# EAGLE design Interface_USB3 (EAGLE 9.6.2)

## Sheet 1 of 4: USB
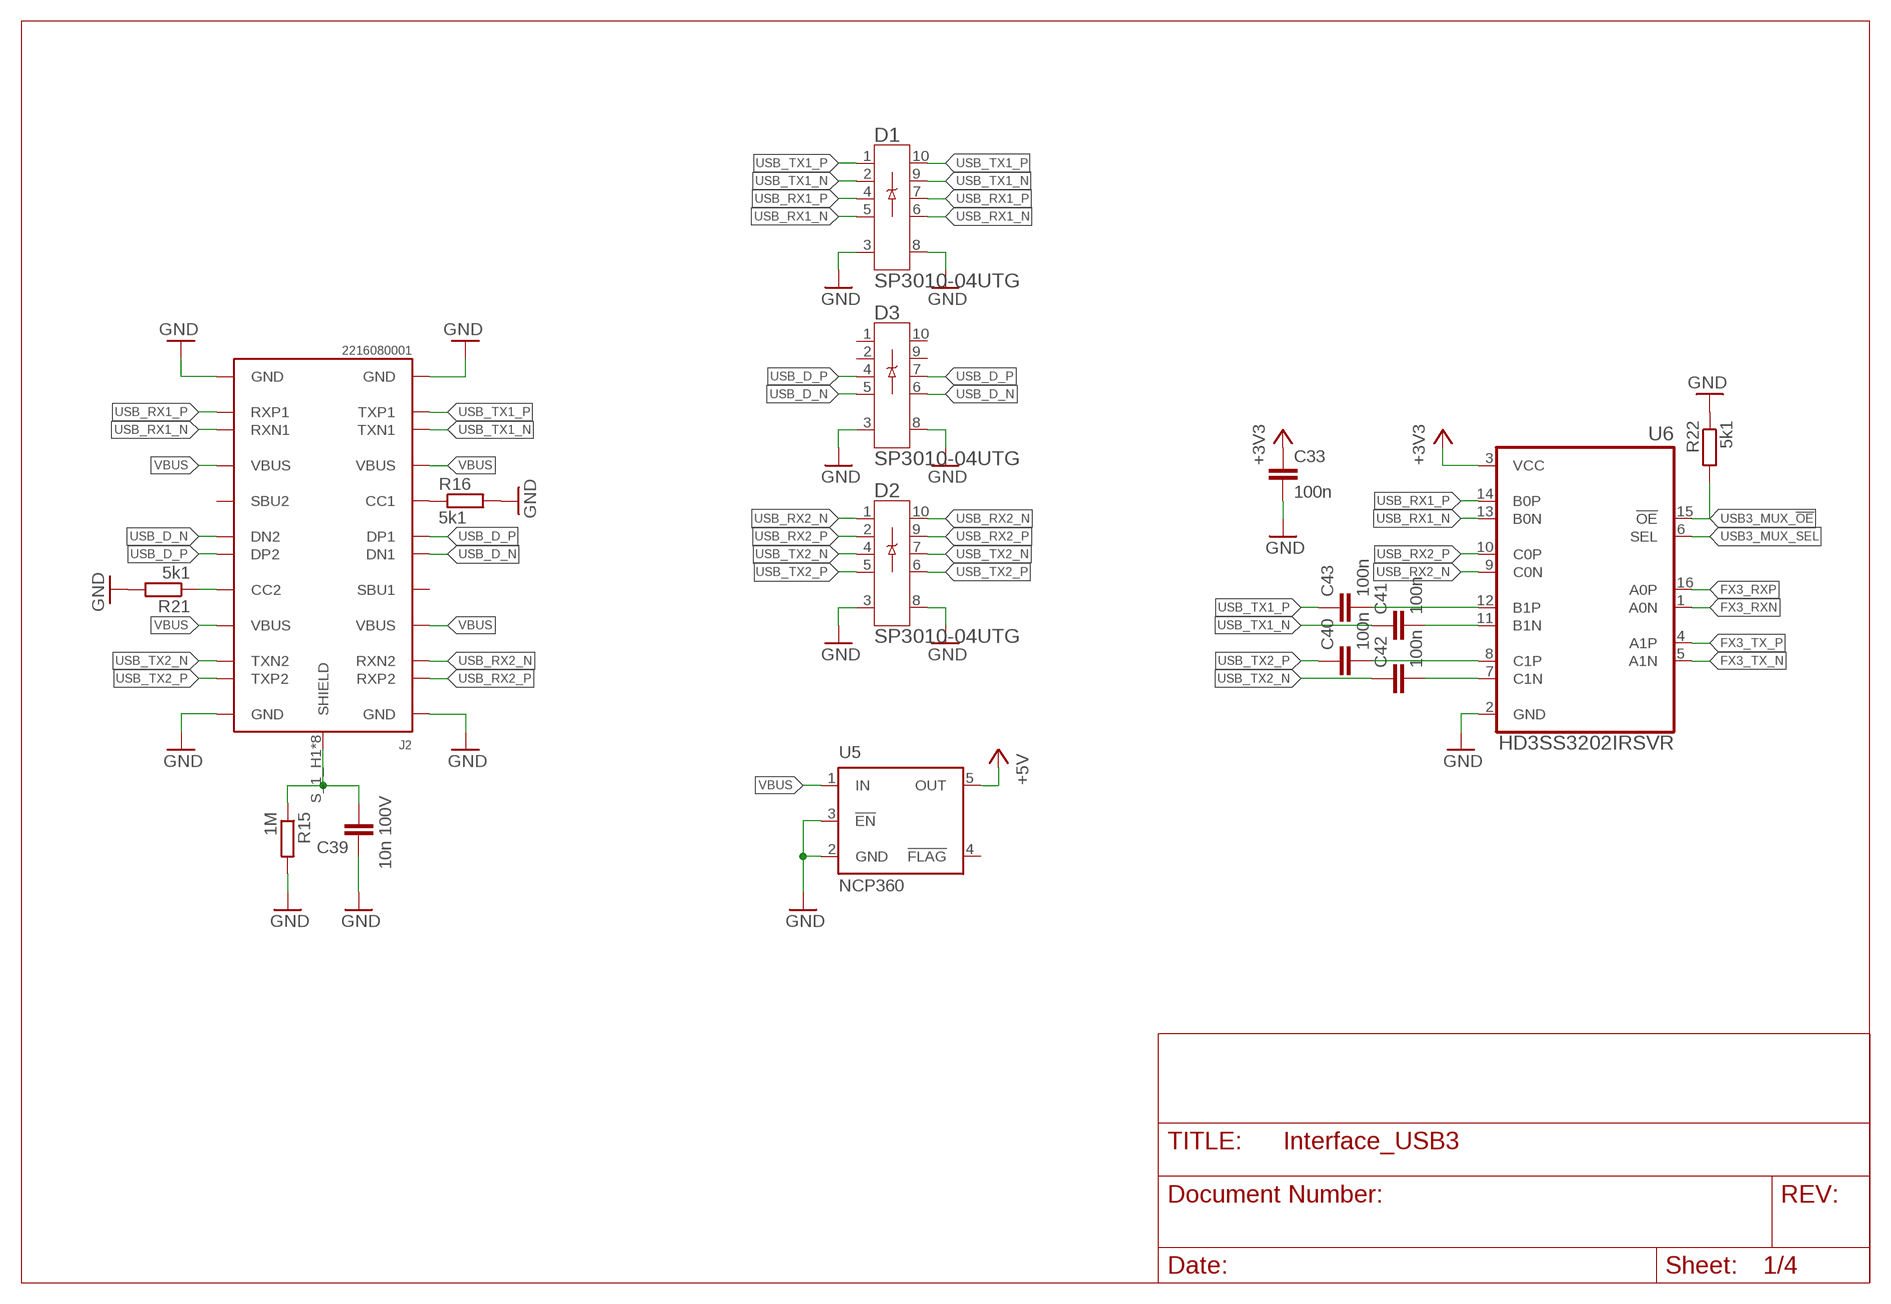
[diagram p0: schematic, sheet 1]

### Parts
C33  100n  C0402  [C0402]
C39  10n 100V  C-EUC0603  [C0603]
C40  100n  C0402  [C0402]
C41  100n  C0402  [C0402]
C42  100n  C0402  [C0402]
C43  100n  C0402  [C0402]
D1  SP3010-04UTG  [UDFEN-10_MO229_LTF]
D2  SP3010-04UTG  [UDFEN-10_MO229_LTF]
D3  SP3010-04UTG  [UDFEN-10_MO229_LTF]
J2  2216080001  [CONN_221608-0001_MOL]
R15  1M  R-EU_R0603  [R0603]
R16  5k1  R-EU_R0402  [R0402]
R21  5k1  R-EU_R0402  [R0402]
R22  5k1  R-EU_R0402  [R0402]
U5  NCP360  [TSOP-5]
U6  HD3SS3202IRSVR  [QFN40P180X260X55-16N_HD3SS3202IRSVR]

### Nets
+3V3: C33.1 U6.3(VCC) ; also sheet 2,3
+5V: U5.5(OUT) ; also sheet 2,3,4
CC1: J2.A5(CC1) R16.1
CC2: J2.B5(CC2) R21.1
FX3_RXN [diff_pair]: U6.1(A0N) ; also sheet 2
FX3_RXP [diff_pair]: U6.16(A0P) ; also sheet 2
FX3_TX_N [diff_pair]: U6.5(A1N) ; also sheet 2
FX3_TX_P [diff_pair]: U6.4(A1P) ; also sheet 2
GND: C33.2 C39.1 D1.3 D1.8 D2.3 D2.8 D3.3 D3.8 J2.A1(GND) J2.A12(GND) J2.B1(GND) J2.B12(GND) R15.2 R16.2 R21.2 R22.1 U5.2(GND) U5.3(!EN) U6.2(GND) ; also sheet 2,3,4
N$00006: C39.2 J2.S_1_H1(SHIELD) J2.S_1_H2(SHIELD) J2.S_2_H1(SHIELD) J2.S_2_H2(SHIELD) J2.S_3_H1(SHIELD) J2.S_3_H2(SHIELD) J2.S_4_H1(SHIELD) J2.S_4_H2(SHIELD) R15.1
N$00015: C42.2 U6.7(C1N)
N$00016: C40.2 U6.8(C1P)
N$00017: C41.2 U6.11(B1N)
N$00018: C43.2 U6.12(B1P)
USB3_MUX_!OE: R22.2 U6.15(!OE) ; also sheet 2
USB3_MUX_SEL: U6.6(SEL) ; also sheet 2
USB_D_N [diff_pair]: D3.5 D3.6 J2.A7(DN1) J2.B7(DN2) ; also sheet 2
USB_D_P [diff_pair]: D3.4 D3.7 J2.A6(DP1) J2.B6(DP2) ; also sheet 2
USB_RX1_N [diff_pair]: D1.5 D1.6 J2.B10(RXN1) U6.13(B0N)
USB_RX1_P [diff_pair]: D1.4 D1.7 J2.B11(RXP1) U6.14(B0P)
USB_RX2_N [diff_pair]: D2.1 D2.10 J2.A10(RXN2) U6.9(C0N)
USB_RX2_P [diff_pair]: D2.2 D2.9 J2.A11(RXP2) U6.10(C0P)
USB_TX1_N [diff_pair]: C41.1 D1.2 D1.9 J2.A3(TXN1)
USB_TX1_P [diff_pair]: C43.1 D1.1 D1.10 J2.A2(TXP1)
USB_TX2_N [diff_pair]: C42.1 D2.4 D2.7 J2.B3(TXN2)
USB_TX2_P [diff_pair]: C40.1 D2.5 D2.6 J2.B2(TXP2)
VBUS: J2.A4(VBUS) J2.A9(VBUS) J2.B4(VBUS) J2.B9(VBUS) U5.1(IN)
Unconnected: D3.1 D3.2 D3.9 D3.10 J2.A8(SBU1) J2.B8(SBU2) U5.4(!FLAG)

## Sheet 2 of 4: FX3
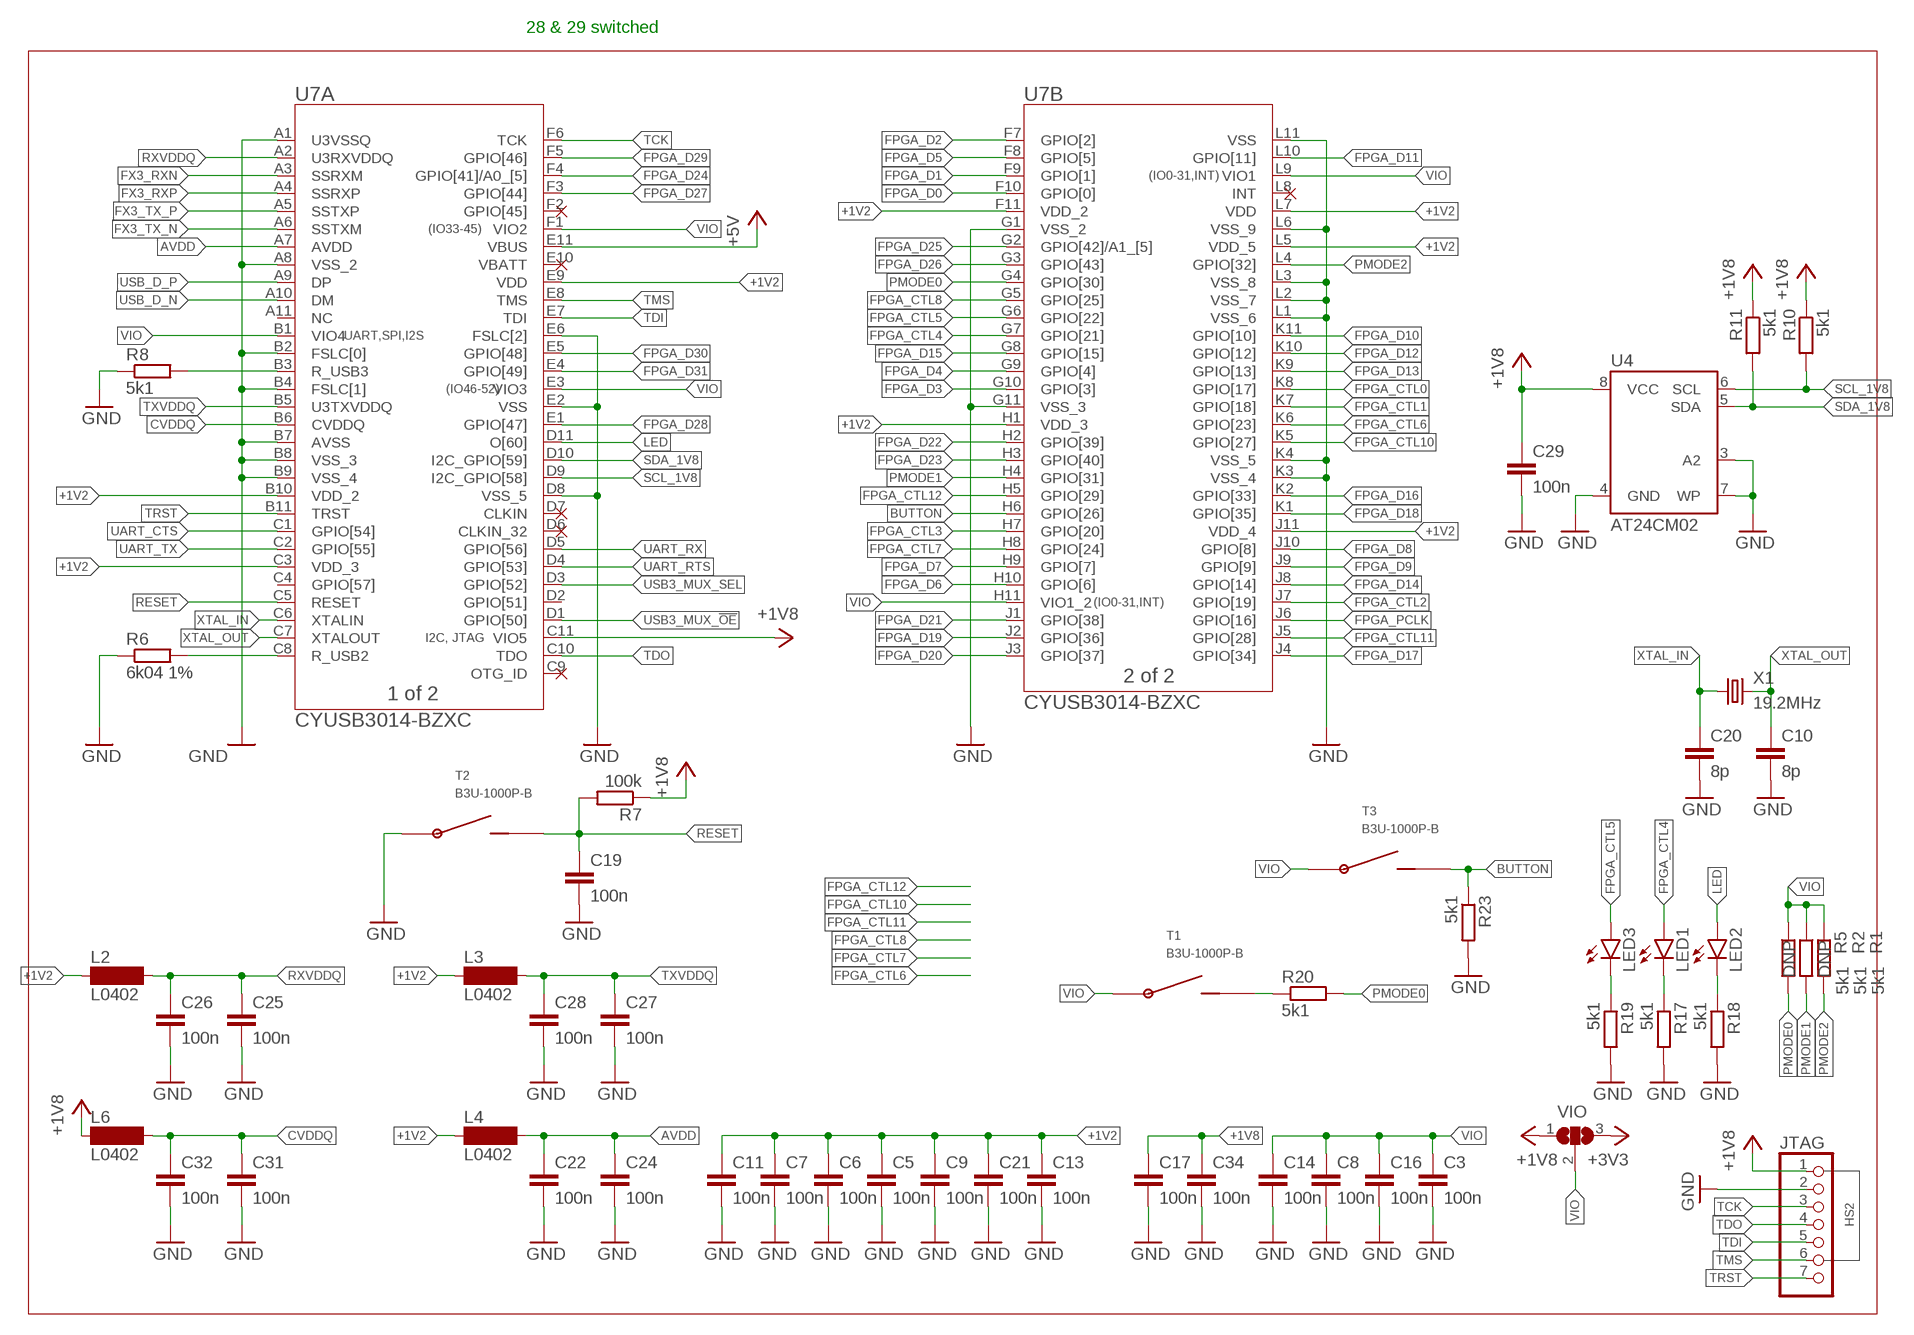
[diagram p1: schematic, sheet 2]

### Parts
C3  100n  C0402  [C0402]
C5  100n  C0402  [C0402]
C6  100n  C0402  [C0402]
C7  100n  C0402  [C0402]
C8  100n  C0402  [C0402]
C9  100n  C0402  [C0402]
C10  8p  C0402  [C0402]
C11  100n  C0402  [C0402]
C13  100n  C0402  [C0402]
C14  100n  C0402  [C0402]
C16  100n  C0402  [C0402]
C17  100n  C0402  [C0402]
C19  100n  C0402  [C0402]
C20  8p  C0402  [C0402]
C21  100n  C0402  [C0402]
C22  100n  C0402  [C0402]
C24  100n  C0402  [C0402]
C25  100n  C0402  [C0402]
C26  100n  C0402  [C0402]
C27  100n  C0402  [C0402]
C28  100n  C0402  [C0402]
C29  100n  C0402  [C0402]
C31  100n  C0402  [C0402]
C32  100n  C0402  [C0402]
C34  100n  C0402  [C0402]
JTAG  PINHD-1X7_2.00  [1X07M]
L2  L0402  [C0402]
L3  L0402  [C0402]
L4  L0402  [C0402]
L6  L0402  [C0402]
LED1  LEDCHIPLED_0603  [CHIPLED_0603]
LED2  LEDCHIPLED_0603  [CHIPLED_0603]
LED3  LEDCHIPLED_0603  [CHIPLED_0603]
R1  5k1  R-EU_R0402  [R0402]
R2  5k1  R-EU_R0402  [R0402]
R5  5k1  R-EU_R0402  [R0402]
R6  6k04 1%  R-EU_R0402  [R0402]
R7  100k  R-EU_R0402  [R0402]
R8  5k1  R-EU_R0402  [R0402]
R10  5k1  R-EU_R0402  [R0402]
R11  5k1  R-EU_R0402  [R0402]
R17  5k1  R-EU_R0402  [R0402]
R18  5k1  R-EU_R0402  [R0402]
R19  5k1  R-EU_R0402  [R0402]
R20  5k1  R-EU_R0402  [R0402]
R23  5k1  R-EU_R0402  [R0402]
T1  B3U-1000P-B  [B3U-1000P-B]
T2  B3U-1000P-B  [B3U-1000P-B]
T3  B3U-1000P-B  [B3U-1000P-B]
U4  AT24CM02  [SOIC8]
U7  CYUSB3014-BZXC  [PG-TFBGA-121-800_INF]
VIO  SJ2W  [SJ_2]
X1  19.2MHz  CRYSTAL-2520  [2520]

### Nets
+1V2: C5.1 C6.1 C7.1 C9.1 C11.1 C13.1 C21.1 L2.1 L3.1 L4.1 U7.B10(A:VDD_2) U7.C3(A:VDD_3) U7.E9(A:VDD) U7.F11(B:VDD_2) U7.H1(B:VDD_3) U7.J11(B:VDD_4) U7.L5(B:VDD_5) U7.L7(B:VDD) ; also sheet 3
+1V8: C17.1 C29.1 C34.1 JTAG.1 L6.1 R7.1 R10.1 R11.1 U4.8(VCC) U7.C11(A:VIO5) VIO.1 ; also sheet 3
+3V3: VIO.3 ; also sheet 1,3
+5V: U7.E11(A:VBUS) ; also sheet 1,3,4
AVDD: C22.1 C24.1 L4.2 U7.A7(A:AVDD)
BUTTON: R23.1 T3.P$2 U7.H6(B:GPIO[26])
CVDDQ: C31.1 C32.1 L6.2 U7.B6(A:CVDDQ)
FPGA_CTL0: U7.K8(B:GPIO[17]) ; also sheet 4
FPGA_CTL1: U7.K7(B:GPIO[18]) ; also sheet 4
FPGA_CTL2: U7.J7(B:GPIO[19]) ; also sheet 4
FPGA_CTL3: U7.H7(B:GPIO[20]) ; also sheet 4
FPGA_CTL4: LED1.A U7.G7(B:GPIO[21])
FPGA_CTL5: LED3.A U7.G6(B:GPIO[22])
FPGA_CTL6: U7.K6(B:GPIO[23])
FPGA_CTL7: U7.H8(B:GPIO[24])
FPGA_CTL8: U7.G5(B:GPIO[25])
FPGA_CTL10: U7.K5(B:GPIO[27])
FPGA_CTL11: U7.J5(B:GPIO[28])
FPGA_CTL12: U7.H5(B:GPIO[29])
FPGA_D0: U7.F10(B:GPIO[0]) ; also sheet 4
FPGA_D1: U7.F9(B:GPIO[1]) ; also sheet 4
FPGA_D2: U7.F7(B:GPIO[2]) ; also sheet 4
FPGA_D3: U7.G10(B:GPIO[3]) ; also sheet 4
FPGA_D4: U7.G9(B:GPIO[4]) ; also sheet 4
FPGA_D5: U7.F8(B:GPIO[5]) ; also sheet 4
FPGA_D6: U7.H10(B:GPIO[6]) ; also sheet 4
FPGA_D7: U7.H9(B:GPIO[7]) ; also sheet 4
FPGA_D8: U7.J10(B:GPIO[8]) ; also sheet 4
FPGA_D9: U7.J9(B:GPIO[9]) ; also sheet 4
FPGA_D10: U7.K11(B:GPIO[10]) ; also sheet 4
FPGA_D11: U7.L10(B:GPIO[11]) ; also sheet 4
FPGA_D12: U7.K10(B:GPIO[12]) ; also sheet 4
FPGA_D13: U7.K9(B:GPIO[13]) ; also sheet 4
FPGA_D14: U7.J8(B:GPIO[14]) ; also sheet 4
FPGA_D15: U7.G8(B:GPIO[15]) ; also sheet 4
FPGA_D16: U7.K2(B:GPIO[33]) ; also sheet 4
FPGA_D17: U7.J4(B:GPIO[34]) ; also sheet 4
FPGA_D18: U7.K1(B:GPIO[35]) ; also sheet 4
FPGA_D19: U7.J2(B:GPIO[36]) ; also sheet 4
FPGA_D20: U7.J3(B:GPIO[37]) ; also sheet 4
FPGA_D21: U7.J1(B:GPIO[38]) ; also sheet 4
FPGA_D22: U7.H2(B:GPIO[39]) ; also sheet 4
FPGA_D23: U7.H3(B:GPIO[40]) ; also sheet 4
FPGA_D24: U7.F4(A:GPIO[41]/A0_[5]) ; also sheet 4
FPGA_D25: U7.G2(B:GPIO[42]/A1_[5]) ; also sheet 4
FPGA_D26: U7.G3(B:GPIO[43]) ; also sheet 4
FPGA_D27: U7.F3(A:GPIO[44]) ; also sheet 4
FPGA_D28: U7.E1(A:GPIO[47]) ; also sheet 4
FPGA_D29: U7.F5(A:GPIO[46]) ; also sheet 4
FPGA_D30: U7.E5(A:GPIO[48]) ; also sheet 4
FPGA_D31: U7.E4(A:GPIO[49]) ; also sheet 4
FPGA_PCLK: U7.J6(B:GPIO[16]) ; also sheet 4
FX3_RXN [diff_pair]: U7.A3(A:SSRXM) ; also sheet 1
FX3_RXP [diff_pair]: U7.A4(A:SSRXP) ; also sheet 1
FX3_TX_N [diff_pair]: U7.A6(A:SSTXM) ; also sheet 1
FX3_TX_P [diff_pair]: U7.A5(A:SSTXP) ; also sheet 1
GND: C3.2 C5.2 C6.2 C7.2 C8.2 C9.2 C10.2 C11.2 C13.2 C14.2 C16.2 C17.2 C19.2 C20.2 C21.2 C22.2 C24.2 C25.2 C26.2 C27.2 C28.2 C29.2 C31.2 C32.2 C34.2 JTAG.2 R6.1 R8.1 R17.2 R18.2 R19.2 R23.2 T2.P$1 U4.3(A2) U4.4(GND) U4.7(WP) U7.A1(A:U3VSSQ) U7.A8(A:VSS_2) U7.B2(A:FSLC[0]) U7.B4(A:FSLC[1]) U7.B7(A:AVSS) U7.B8(A:VSS_3) U7.B9(A:VSS_4) U7.D8(A:VSS_5) U7.E2(A:VSS) U7.E6(A:FSLC[2]) U7.G1(B:VSS_2) U7.G11(B:VSS_3) U7.K3(B:VSS_4) U7.K4(B:VSS_5) U7.L1(B:VSS_6) U7.L2(B:VSS_7) U7.L3(B:VSS_8) U7.L6(B:VSS_9) U7.L11(B:VSS) ; also sheet 1,3,4
LED: LED2.A U7.D11(A:O[60])
N$00003: LED2.C R18.1
N$00009: R6.2 U7.C8(A:R_USB2)
N$00011: R8.2 U7.B3(A:R_USB3)
N$00013: LED1.C R17.1
N$00014: LED3.C R19.1
N$00019: R20.1 T1.P$2
PMODE0: R5.2 R20.2 U7.G4(B:GPIO[30])
PMODE1: R2.2 U7.H4(B:GPIO[31])
PMODE2: R1.2 U7.L4(B:GPIO[32])
RESET: C19.1 R7.2 T2.P$2 U7.C5(A:RESET)
RXVDDQ: C25.1 C26.1 L2.2 U7.A2(A:U3RXVDDQ)
SCL_1V8: R10.2 U4.6(SCL) U7.D9(A:I2C_GPIO[58])
SDA_1V8: R11.2 U4.5(SDA) U7.D10(A:I2C_GPIO[59])
TCK: JTAG.3 U7.F6(A:TCK)
TDI: JTAG.5 U7.E7(A:TDI)
TDO: JTAG.4 U7.C10(A:TDO)
TMS: JTAG.6 U7.E8(A:TMS)
TRST: JTAG.7 U7.B11(A:TRST)
TXVDDQ: C27.1 C28.1 L3.2 U7.B5(A:U3TXVDDQ)
UART_CTS: U7.C1(A:GPIO[54]) ; also sheet 4
UART_RTS: U7.D4(A:GPIO[53]) ; also sheet 4
UART_RX: U7.D5(A:GPIO[56]) ; also sheet 4
UART_TX: U7.C2(A:GPIO[55]) ; also sheet 4
USB3_MUX_!OE: U7.D1(A:GPIO[50]) ; also sheet 1
USB3_MUX_SEL: U7.D3(A:GPIO[52]) ; also sheet 1
USB_D_N [diff_pair]: U7.A10(A:DM) ; also sheet 1
USB_D_P [diff_pair]: U7.A9(A:DP) ; also sheet 1
VIO: C3.1 C8.1 C14.1 C16.1 R1.1 R2.1 R5.1 T1.P$1 T3.P$1 U7.B1(A:VIO4) U7.E3(A:VIO3) U7.F1(A:VIO2) U7.H11(B:VIO1_2) U7.L9(B:VIO1) VIO.2
XTAL_IN: C20.1 U7.C6(A:XTALIN) X1.1
XTAL_OUT: C10.1 U7.C7(A:XTALOUT) X1.3
Unconnected: U7.A11(A:NC) U7.C4(A:GPIO[57]) U7.C9(A:OTG_ID) U7.D2(A:GPIO[51]) U7.D6(A:CLKIN_32) U7.D7(A:CLKIN) U7.F2(A:GPIO[45]) U7.L8(B:INT)

### Notes on the sheet
- 28 & 29 switched
- (IO0-31,INT)
- (IO33-45)
- UART,SPI,I2S
- (IO46-52)
- (IO0-31,INT)
- I2C, JTAG
- HS2

## Sheet 3 of 4: Power
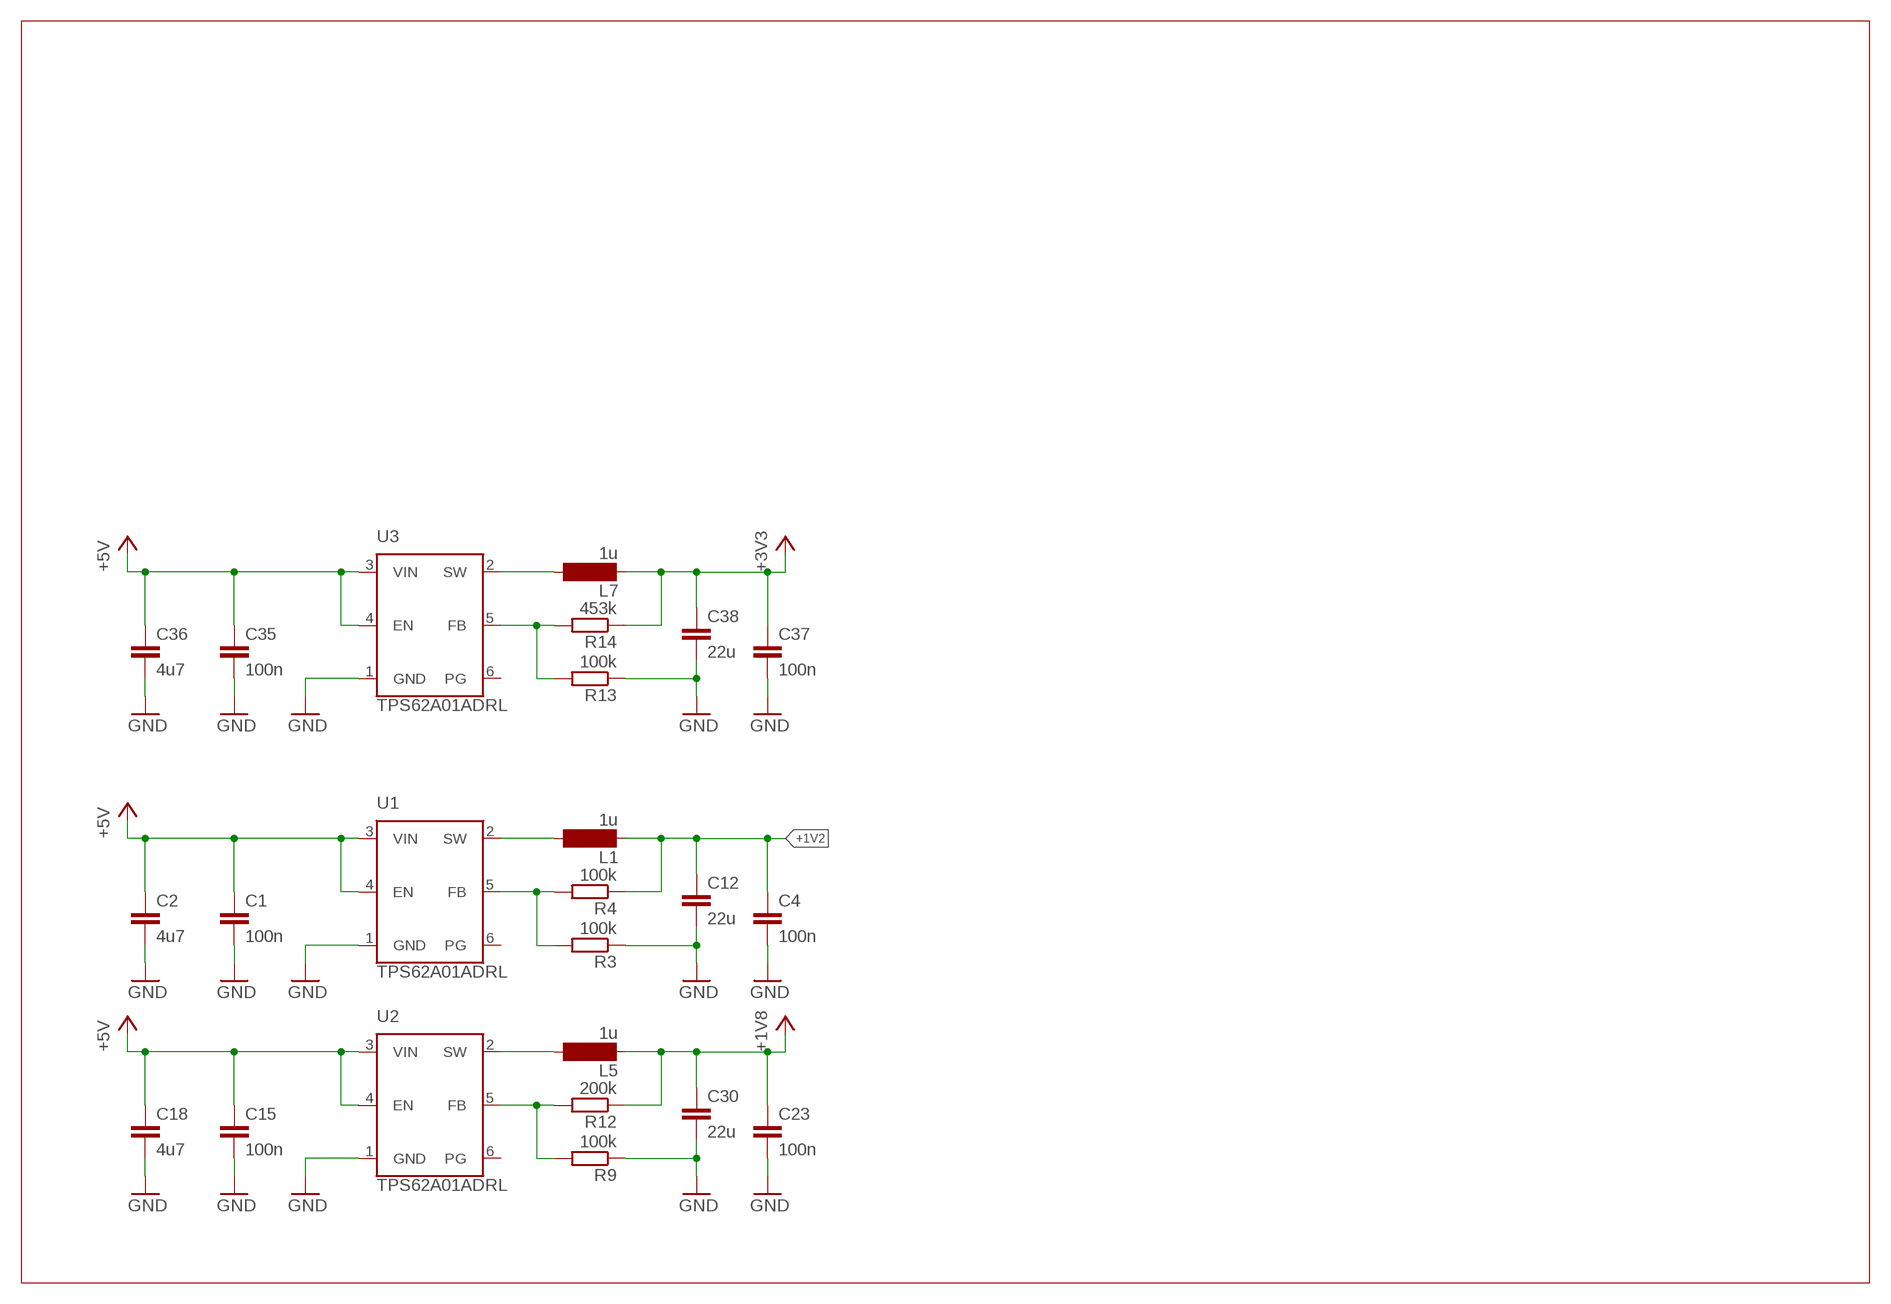
[diagram p2: schematic, sheet 3]

### Parts
C1  100n  C0402  [C0402]
C2  4u7  C-EUC0603  [C0603]
C4  100n  C0402  [C0402]
C12  22u  C-EUC0603  [C0603]
C15  100n  C0402  [C0402]
C18  4u7  C-EUC0603  [C0603]
C23  100n  C0402  [C0402]
C30  22u  C-EUC0603  [C0603]
C35  100n  C0402  [C0402]
C36  4u7  C-EUC0603  [C0603]
C37  100n  C0402  [C0402]
C38  22u  C-EUC0603  [C0603]
L1  1u  L1008  [L1008]
L5  1u  L1008  [L1008]
L7  1u  L1008  [L1008]
R3  100k  R-EU_R0402  [R0402]
R4  100k  R-EU_R0402  [R0402]
R9  100k  R-EU_R0402  [R0402]
R12  200k  R-EU_R0402  [R0402]
R13  100k  R-EU_R0402  [R0402]
R14  453k  R-EU_R0402  [R0402]
U1  TPS62A01ADRL  [SOTFL50P160X60-6N]
U2  TPS62A01ADRL  [SOTFL50P160X60-6N]
U3  TPS62A01ADRL  [SOTFL50P160X60-6N]

### Nets
+1V2: C4.1 C12.1 L1.1 R4.1 ; also sheet 2
+1V8: C23.1 C30.1 L5.1 R12.1 ; also sheet 2
+3V3: C37.1 C38.1 L7.1 R14.1 ; also sheet 1,2
+5V: C1.1 C2.1 C15.1 C18.1 C35.1 C36.1 U1.3(VIN) U1.4(EN) U2.3(VIN) U2.4(EN) U3.3(VIN) U3.4(EN) ; also sheet 1,2,4
GND: C1.2 C2.2 C4.2 C12.2 C15.2 C18.2 C23.2 C30.2 C35.2 C36.2 C37.2 C38.2 R3.1 R9.1 R13.1 U1.1(GND) U2.1(GND) U3.1(GND) ; also sheet 1,2,4
N$00005: L1.2 U1.2(SW)
N$00010: L7.2 U3.2(SW)
N$00012: R13.2 R14.2 U3.5(FB)
N$00040: R3.2 R4.2 U1.5(FB)
N$00045: L5.2 U2.2(SW)
N$00049: R9.2 R12.2 U2.5(FB)
Unconnected: U1.6(PG) U2.6(PG) U3.6(PG)

## Sheet 4 of 4
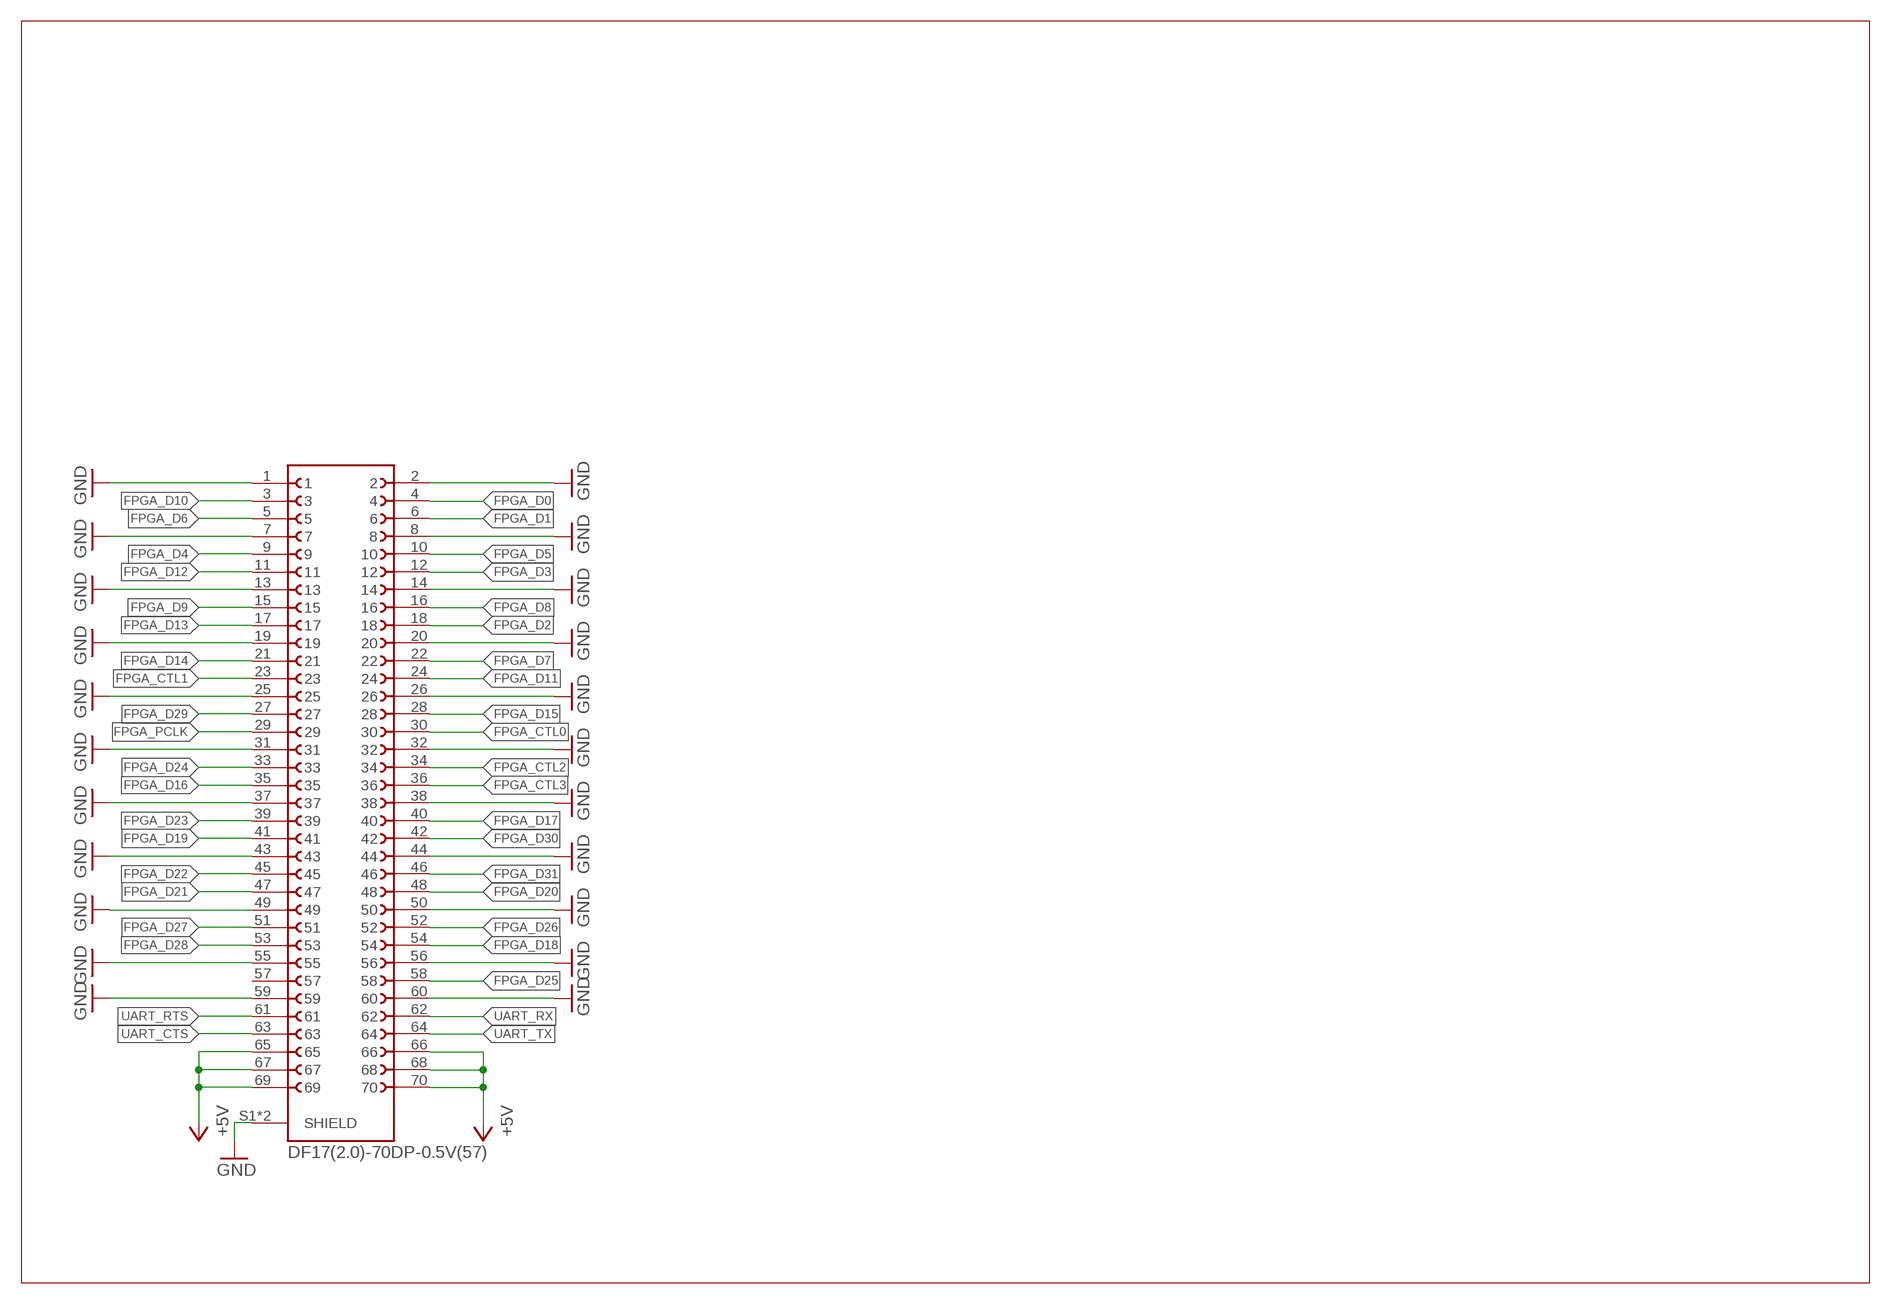
[diagram p3: schematic, sheet 4]

### Parts
J1  DF17(2.0)-70DP-0.5V(57)  [DF17(2.0)-70DP-0.5V(57)]

### Nets
+5V: J1.65 J1.66 J1.67 J1.68 J1.69 J1.70 ; also sheet 1,2,3
FPGA_CTL0: J1.30 ; also sheet 2
FPGA_CTL1: J1.23 ; also sheet 2
FPGA_CTL2: J1.34 ; also sheet 2
FPGA_CTL3: J1.36 ; also sheet 2
FPGA_D0: J1.4 ; also sheet 2
FPGA_D1: J1.6 ; also sheet 2
FPGA_D2: J1.18 ; also sheet 2
FPGA_D3: J1.12 ; also sheet 2
FPGA_D4: J1.9 ; also sheet 2
FPGA_D5: J1.10 ; also sheet 2
FPGA_D6: J1.5 ; also sheet 2
FPGA_D7: J1.22 ; also sheet 2
FPGA_D8: J1.16 ; also sheet 2
FPGA_D9: J1.15 ; also sheet 2
FPGA_D10: J1.3 ; also sheet 2
FPGA_D11: J1.24 ; also sheet 2
FPGA_D12: J1.11 ; also sheet 2
FPGA_D13: J1.17 ; also sheet 2
FPGA_D14: J1.21 ; also sheet 2
FPGA_D15: J1.28 ; also sheet 2
FPGA_D16: J1.35 ; also sheet 2
FPGA_D17: J1.40 ; also sheet 2
FPGA_D18: J1.54 ; also sheet 2
FPGA_D19: J1.41 ; also sheet 2
FPGA_D20: J1.48 ; also sheet 2
FPGA_D21: J1.47 ; also sheet 2
FPGA_D22: J1.45 ; also sheet 2
FPGA_D23: J1.39 ; also sheet 2
FPGA_D24: J1.33 ; also sheet 2
FPGA_D25: J1.58 ; also sheet 2
FPGA_D26: J1.52 ; also sheet 2
FPGA_D27: J1.51 ; also sheet 2
FPGA_D28: J1.53 ; also sheet 2
FPGA_D29: J1.27 ; also sheet 2
FPGA_D30: J1.42 ; also sheet 2
FPGA_D31: J1.46 ; also sheet 2
FPGA_PCLK: J1.29 ; also sheet 2
GND: J1.1 J1.2 J1.7 J1.8 J1.13 J1.14 J1.19 J1.20 J1.25 J1.26 J1.31 J1.32 J1.37 J1.38 J1.43 J1.44 J1.49 J1.50 J1.55 J1.56 J1.59 J1.60 J1.S1(SHIELD) J1.S2(SHIELD) ; also sheet 1,2,3
UART_CTS: J1.63 ; also sheet 2
UART_RTS: J1.61 ; also sheet 2
UART_RX: J1.62 ; also sheet 2
UART_TX: J1.64 ; also sheet 2
Unconnected: J1.57

## Power pins joined to a net without a drawn wire
VBATT: U7.E10(A:VBATT)

## Library data of the parts
C1 C3-C9 C11 C13-C17 C19 C21-C29 C31-C35 C37 C40-C43 = misc:C; LCSC: C1525
C2 C18 C36 = rcl:C-EU: CAPACITOR, European symbol; LCSC: C19666
C10 C20 = misc:C; LCSC: C281765
C12 C30 C38 = rcl:C-EU: CAPACITOR, European symbol; LCSC: C723633
C39 = rcl:C-EU: CAPACITOR, European symbol; LCSC: C84709; SPICEPREFIX: C
D1-D3 = onsemi:SP3010-04UTG; LCSC: C126837; MANUFACTURER_NAME: Littelfuse Inc; MPN: SP3010-04UTG
J1 = Hirose:DF17(2.0)-70DP-0.5V(57)
J2 = con-molex:2216080001; DIGIKEY: 900-2216080001CT-ND; MANUFACTURER_PART_NUMBER: 2216080001; MFR_NAME: Molex Connector Corporation; TYPE: USB, DVI, HDMI, Connectors
JTAG = pinhead-1:PINHD-1X7: PIN HEADER
L1 L5 L7 = misc:L; DIGIKEY: 490-5112-1-ND; LCSC: C86091; MPN: LQM2HPN1R0MG0L
L2-L4 L6 = misc:L; LCSC: C88970
LED1-LED3 = led:LED: LED OSRAM: - CHIPLED LG R971, LG N971, LY N971, LG Q971, LY Q971, LO R971, LY R971 LH N974, LH R974 LS Q976, LO Q976, LY Q976 LO Q996 - Hyper CHIPLED LW Q18S LB Q993, LB Q99A, LB R99A - SideLED LS A670, LO A670, LY A670, LG A670, LP A670 LB A673, LV A673, LT A673, LW A673 LH A674 LY A675 LS A676, LA A676, LO A676, LY A676, LW A676 LS A679, LY A679, LG A679 - Hyper Micro SIDELED® LS Y876, LA Y876, LO Y876, LY Y876 LT Y87S - SmartLED LW L88C, LW L88S LB L89C, LB L89S, LG L890 LS L89K, LO L89K, LY L89K LS L896, LA L896, LO L896, LY L896 - TOPLED LS T670, LO T670, LY T670, LG T670, LP T670 LSG T670, LSP T670, LSY T670, LOP T670, LYG T670 LG T671, LOG T671, LSG T671 LB T673, LV T673, LT T673, LW T673 LH T674 LS T676, LA T676, LO T676, LY T676, LB T676, LH T676, LSB T676, LW T676 LB T67C, LV T67C, LT T67C, LS T67K, LO T67K, LY T67K, LW E67C LS E67B, LA E67B, LO E67B, LY E67B, LB E67C, LV E67C, LT E67C LW T67C LS T679, LY T679, LG T679 LS T770, LO T770, LY T770, LG T770, LP T770 LB T773, LV T773, LT T773, LW T773 LH T774 LS E675, LA E675, LY E675, LS T675 LS T776, LA T776, LO T776, LY T776, LB T776 LHGB T686 LT T68C, LB T68C - Hyper Mini TOPLED® LB M676 - Mini TOPLED Santana® LG M470 LS M47K, LO M47K, LY M47K Source: http://www.osram.convergy.de LUXEON: - LUMILED® LXK2-PW12-R00, LXK2-PW12-S00, LXK2-PW14-U00, LXK2-PW14-V00 LXK2-PM12-R00, LXK2-PM12-S00, LXK2-PM14-U00 LXK2-PE12-Q00, LXK2-PE12-R00, LXK2-PE12-S00, LXK2-PE14-T00, LXK2-PE14-U00 LXK2-PB12-K00, LXK2-PB12-L00, LXK2-PB12-M00, LXK2-PB14-N00, LXK2-PB14-P00, LXK2-PB14-Q00 LXK2-PR12-L00, LXK2-PR12-M00, LXK2-PR14-Q00, LXK2-PR14-R00 LXK2-PD12-Q00, LXK2-PD12-R00, LXK2-PD12-S00 LXK2-PH12-R00, LXK2-PH12-S00 LXK2-PL12-P00, LXK2-PL12-Q00, LXK2-PL12-R00 Source: www.luxeon.com KINGBRIGHT: KA-3528ASYC Source: www.kingbright.com; LCSC: C7493803
R1 R5 = rcl:R-EU_: RESISTOR, European symbol; DNP: DNP; LCSC: C105872; SPICEPREFIX: R
R2 R8 R10 R11 R16-R23 = rcl:R-EU_: RESISTOR, European symbol; LCSC: C105872; SPICEPREFIX: R
R3 R4 R7 R9 R13 = rcl:R-EU_: RESISTOR, European symbol; DIGIKEY: RMCF0402FT100KCT-ND; LCSC: C60491; SPICEPREFIX: R
R6 = rcl:R-EU_: RESISTOR, European symbol; LCSC: C97819; SPICEPREFIX: R
R12 = rcl:R-EU_: RESISTOR, European symbol; DIGIKEY: 311-200KLRCT-ND; LCSC: C114763; SPICEPREFIX: R
R14 = rcl:R-EU_: RESISTOR, European symbol; LCSC: C137978; SPICEPREFIX: R
R15 = rcl:R-EU_: RESISTOR, European symbol; LCSC: C22935; SPICEPREFIX: R
T1-T3 = Filterschieber-Platine:B3U-1000P-B; FARNELL: 1333654; MBM: 5; PREIS: 1,02
U1-U3 = TPS62A01DRLR:TPS62A01ADRL; DESCRIPTION: 2.5V-5.5V input, 1-A high efficiency step-down converter in 2x2 QFN or SOT563 package; DIGIKEY: 296-TPS62A01ADRLRCT-ND; HEIGHT: 0.6mm; LCSC: C5181455; MANUFACTURER_NAME: Texas Instruments; MANUFACTURER_PART_NUMBER: TPS62A01ADRLR; MOUSER: 595-TPS62A01ADRLR
U4 = atmel-2005:AT24CM02: Microchip AT24CM02 I²C-Compatible (Two-Wire) Serial EEPROM 2‑Mbit (262,144 x 8); DIGIKEY: AT24CM02-SSHD-B-ND; LCSC: C779670
U5 = onsemi:NCP360: onsemi NCP360, NCV360 USB Positive Overvoltage Protection Controller; DIGIKEY: NCP360SNT1GOSCT-ND; LCSC: C603707
U6 = texas:HD3SS3202IRSVR; LCSC: C2150836; MANUFACTURER: Texas Instruments; MAXIMUM_PACKAGE_HEIGHT: 0.55 mm; STANDARD: IPC 7351B
U7 = cypress:CYUSB3014-BZXC; LCSC: C462526; MPN: CYUSB3014-BZXC
VIO = jumper:SJ2W: SMD solder JUMPER
X1 = crystal:CRYSTAL: Crystal Resonator; DIGIKEY: XC3048CT-ND; LCSC: C24833836

## Net classes
0 default: width 0.15 mm, drill 0.3 mm
1 diff_pair: width 0.15 mm, drill 0.3 mm

## Board
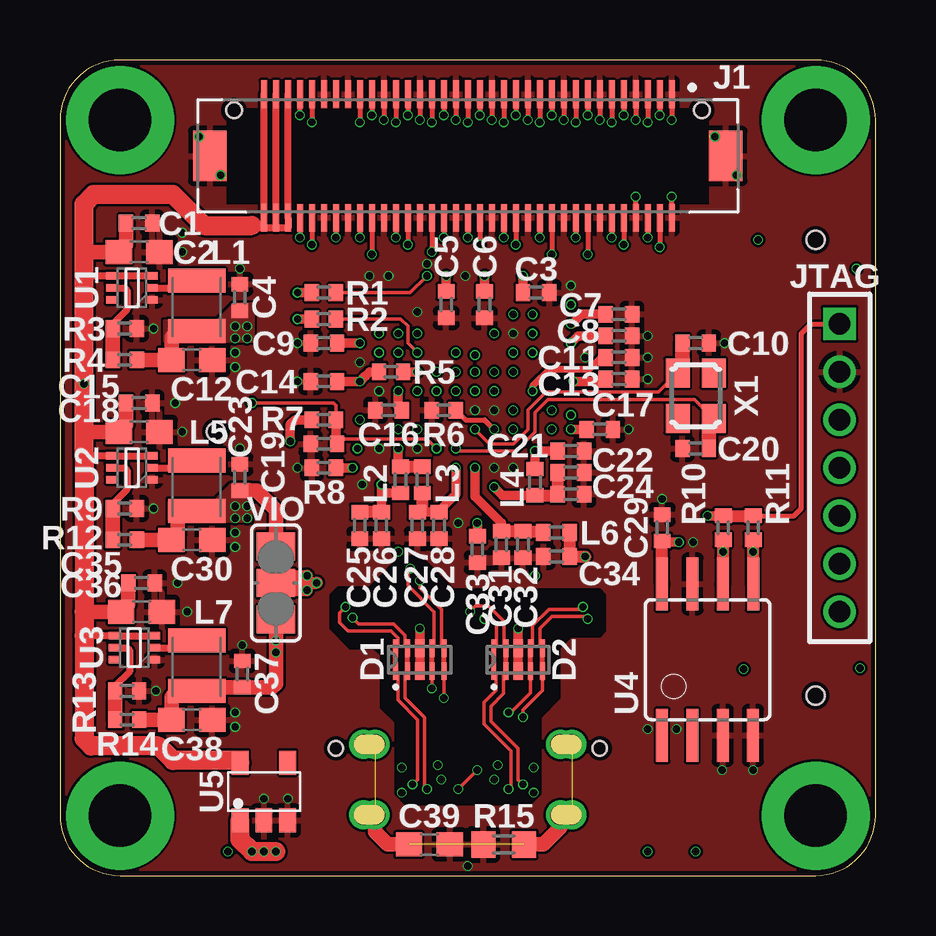
[diagram p4: board, top side]
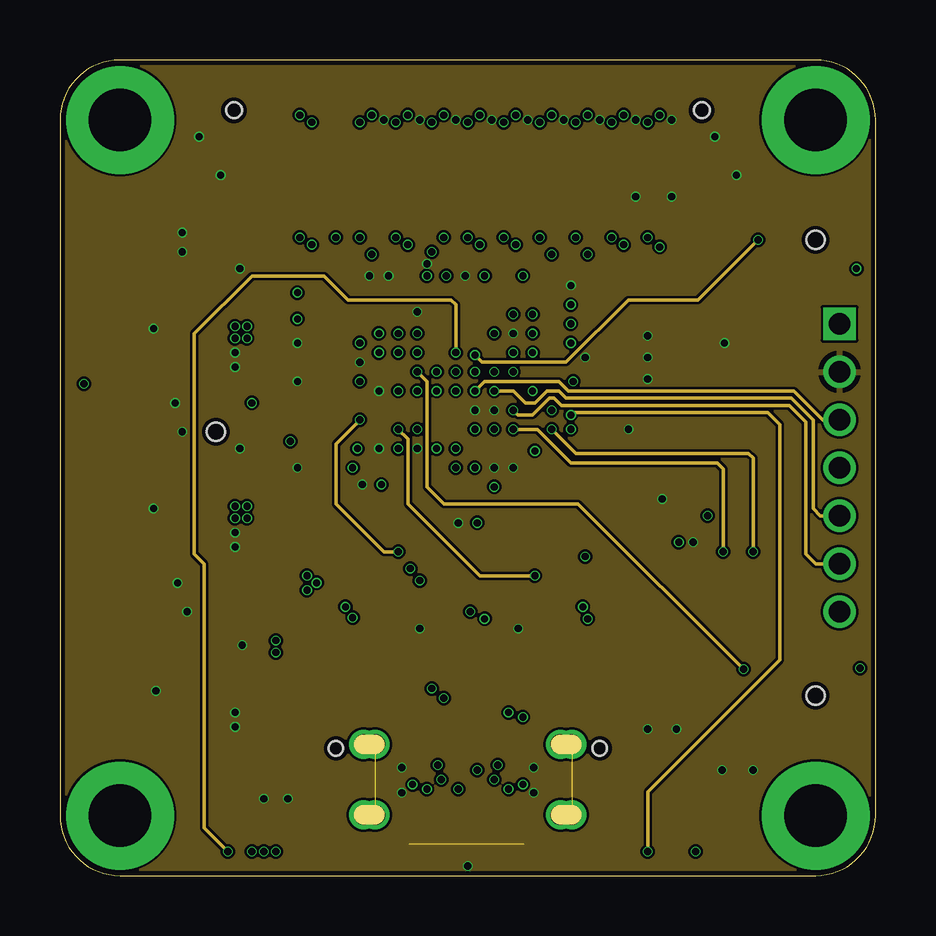
[diagram p5: board, inner layer Route2]
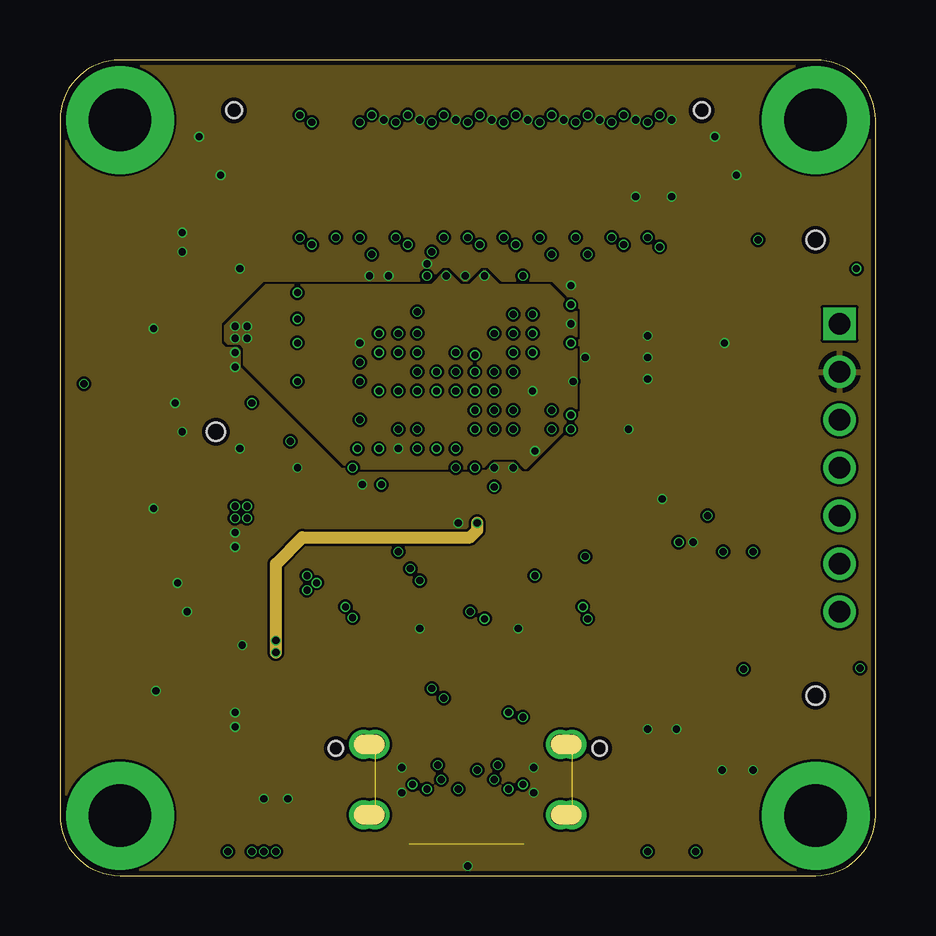
[diagram p6: board, inner layer Route3]
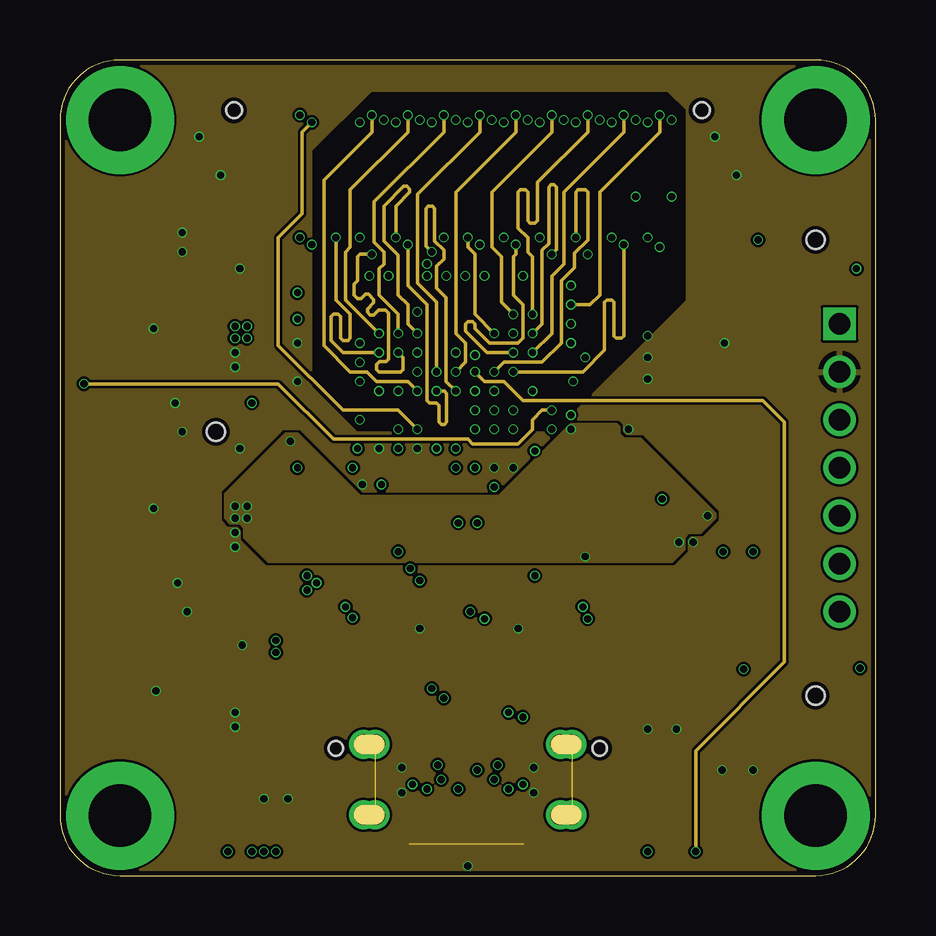
[diagram p7: board, inner layer Route14]
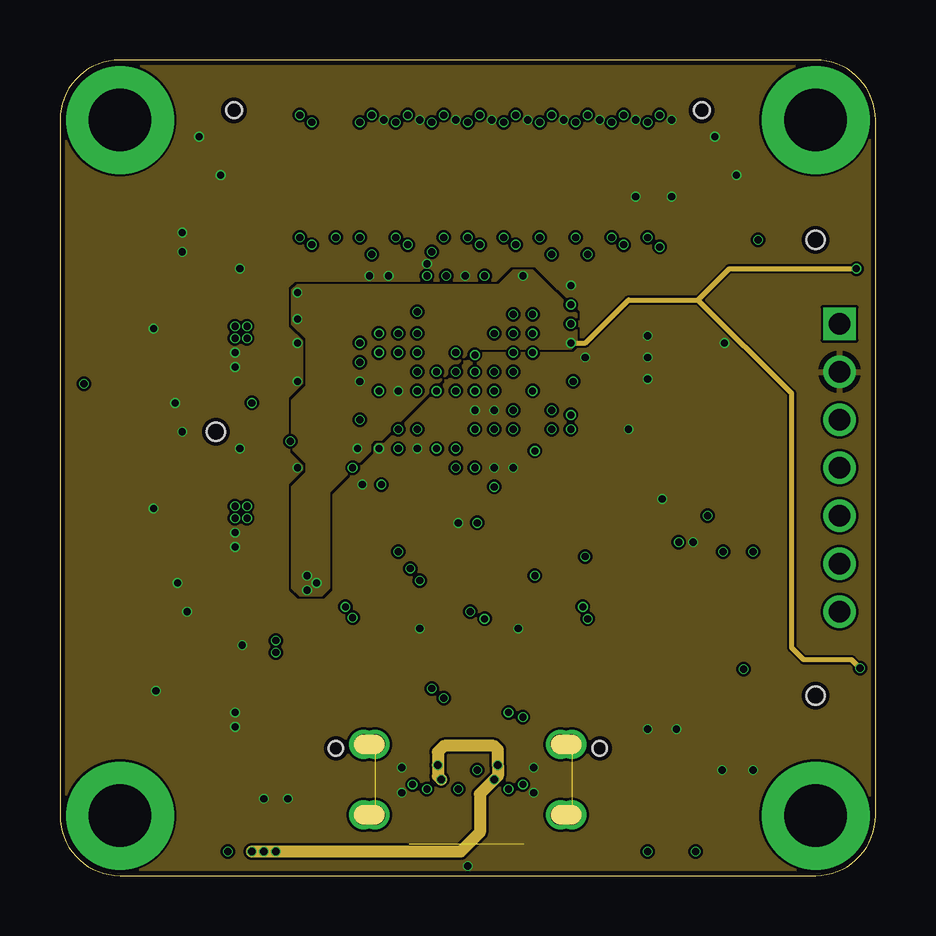
[diagram p8: board, inner layer Route15]
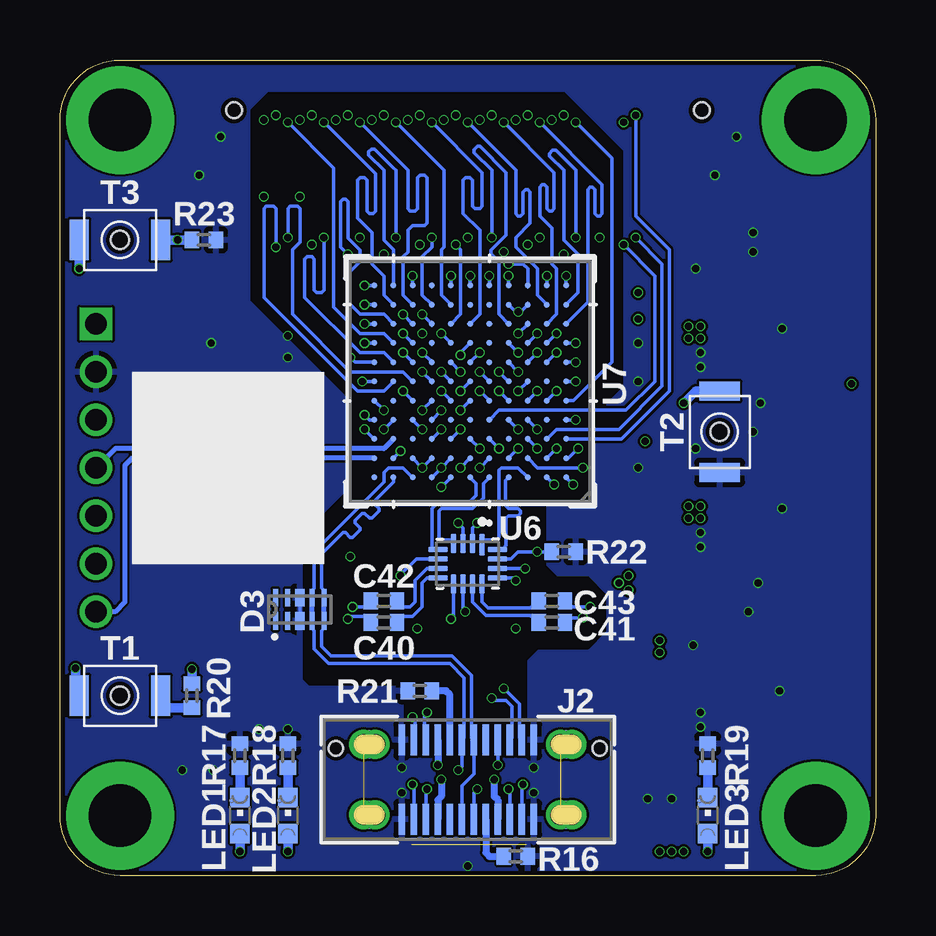
[diagram p9: board, bottom side, seen from below]

Size 34 x 34 mm. Coordinates in mm from the lower left corner, seen from the top.
Outline: 0,31.5 0,2.5 arc90 2.5,0 31.5,0 arc90 34,2.5 34,31.5 arc90 31.5,34 2.5,34 arc90 0,31.5
Copper layers (1+2*3+14*15+16): Top 0.035559375mm / dielectric 0.17018125mm / Route2 0.01778125mm / dielectric 47mil / Route3 0.0356mm / dielectric 0.2007mm / Route14 0.0356mm / dielectric 0.1499mm / Route15 0.01778125mm / dielectric 0.17018125mm / Bottom 0.035559375mm
Design rules "jlcpcb-4-layer *": minimum track width 4mil, minimum drill 0.2mm, track to track 4mil, track to pad 4mil, pad to pad 4mil, via to via 4mil, smd to smd 0mil, copper to edge 0.2mm, drill to drill 0.2mm, minimum pad ring 4mil, minimum via ring 0.05mm, stop-mask expansion 3mil, vias tented up to drill 100mil, thermal gap 8mil

### Footprints (pad centres in the part's own frame; a part is rotated, then mirrored left to right if it is on the bottom)
C0402 = smd 0.6 x 0.7: 1 -0.55,0; 2 0.55,0
C0603 = smd 1.1 x 1: 1 -0.85,0; 2 0.85,0
UDFEN-10_MO229_LTF = smd 0.737 x 0.203: 1 -0.483,1.016; 2 -0.483,0.508; 4 -0.483,-0.508; 5 -0.483,-1.016; 6 0.483,-1.016; 7 0.483,-0.508; 9 0.483,0.508; 10 0.483,1.016 | smd 0.737 x 0.406: 3 -0.483,0; 8 0.483,0
DF17(2.0)-70DP-0.5V(57) = smd 0.25 x 1.15: 1 -8.5,-2.575; 2 -8.5,2.575; 3 -8,-2.575; 4 -8,2.575; 5 -7.5,-2.575; 6 -7.5,2.575; 7 -7,-2.575; 8 -7,2.575; 9 -6.5,-2.575; 10 -6.5,2.575; 11 -6,-2.575; 12 -6,2.575; 13 -5.5,-2.575; 14 -5.5,2.575; 15 -5,-2.575; 16 -5,2.575; 17 -4.5,-2.575; 18 -4.5,2.575; 19 -4,-2.575; 20 -4,2.575; 21 -3.5,-2.575; 22 -3.5,2.575; 23 -3,-2.575; 24 -3,2.575; 25 -2.5,-2.575; 26 -2.5,2.575; 27 -2,-2.575; 28 -2,2.575; 29 -1.5,-2.575; 30 -1.5,2.575; 31 -1,-2.575; 32 -1,2.575; 33 -0.5,-2.575; 34 -0.5,2.575; 35 0,-2.575; 36 0,2.575; 37 0.5,-2.575; 38 0.5,2.575; 39 1,-2.575; 40 1,2.575; 41 1.5,-2.575; 42 1.5,2.575; 43 2,-2.575; 44 2,2.575; 45 2.5,-2.575; 46 2.5,2.575; 47 3,-2.575; 48 3,2.575; 49 3.5,-2.575; 50 3.5,2.575; 51 4,-2.575; 52 4,2.575; 53 4.5,-2.575; 54 4.5,2.575; 55 5,-2.575; 56 5,2.575; 57 5.5,-2.575; 58 5.5,2.575; 59 6,-2.575; 60 6,2.575; 61 6.5,-2.575; 62 6.5,2.575; 63 7,-2.575; 64 7,2.575; 65 7.5,-2.575; 66 7.5,2.575; 67 8,-2.575; 68 8,2.575; 69 8.5,-2.575; 70 8.5,2.575 | smd 1.4 x 2.1: S1 -10.75,0; S2 10.75,0 | hole 0.65: -9.75,-1.9; 9.75,-1.9
CONN_221608-0001_MOL = smd 1.702 x 1.194: 25 -4.1,1.47; 26 4.1,1.47; 27 -4.1,-1.47; 28 4.1,-1.47 | smd 0.279 x 1.295: A1 2.75,-1.65; A2 2.25,-1.65; A3 1.75,-1.65; A4 1.25,-1.65; A5 0.75,-1.65; A6 0.25,-1.65; A7 -0.25,-1.65; A8 -0.75,-1.65; A9 -1.25,-1.65; A10 -1.75,-1.65; A11 -2.25,-1.65; A12 -2.75,-1.65; B1 -2.75,1.65; B2 -2.25,1.65; B3 -1.75,1.65; B4 -1.25,1.65; B5 -0.75,1.65; B6 -0.25,1.65; B7 0.25,1.65; B8 0.75,1.65; B9 1.25,1.65; B10 1.75,1.65; B11 2.25,1.65; B12 2.75,1.65 | drill 0.813 pad 0.813: S_1_H1 -3.861,1.473; S_1_H2 -4.343,1.473; S_2_H1 4.343,1.473; S_2_H2 3.861,1.473; S_3_H1 -3.861,-1.473; S_3_H2 -4.343,-1.473; S_4_H1 4.343,-1.473; S_4_H2 3.861,-1.473 | hole 0.6: 5.5,1.3; -5.5,1.3
1X07M = drill 0.914 square: 1 -6,0 | drill 0.914: 2 -4,0; 3 -2,0; 4 0,0; 5 2,0; 6 4,0; 7 6,0
L1008 = smd 1 x 2.4: 1 -1,0; 2 1.1,0
CHIPLED_0603 = smd 0.8 x 0.8: A 0,-0.75; C 0,0.75
R0402 = smd 0.6 x 0.7: 1 -0.5,0; 2 0.5,0
R0603 = smd 1 x 1.1: 1 -0.85,0; 2 0.85,0
B3U-1000P-B = smd 0.8 x 1.7: P$1 1.7,0; P$2 -1.7,0 | hole 0.75: 0,0
SOTFL50P160X60-6N = smd 0.475 x 0.3: 1 -0.838,0.5; 2 -0.838,0; 3 -0.838,-0.5; 4 0.838,-0.5; 5 0.838,0; 6 0.838,0.5
SOIC8 = smd 0.5 x 2.2: 1 -1.905,-3.154; 2 -0.645,-3.154; 3 0.625,-3.154; 4 1.895,-3.154; 5 1.905,3.154; 6 0.635,3.154; 7 -0.635,3.154; 8 -1.905,3.154
TSOP-5 = smd 0.7 x 1: 1 -0.99,-1.2; 2 0,-1.2; 3 0.99,-1.2; 4 0.99,1.2; 5 -0.99,1.2
QFN40P180X260X55-16N_HD3SS3202IRSVR = smd 0.91 x 0.22: 1 -0.795,0.6 | smd 0.81 x 0.22: 2 -0.845,0.2; 3 -0.845,-0.2; 4 -0.845,-0.6; 9 0.845,-0.6; 10 0.845,-0.2; 11 0.845,0.2; 12 0.845,0.6 | smd 0.22 x 0.81: 5 -0.6,-1.245; 6 -0.2,-1.245; 7 0.2,-1.245; 8 0.6,-1.245; 13 0.6,1.245; 14 0.2,1.245; 15 -0.2,1.245; 16 -0.6,1.245
PG-TFBGA-121-800_INF = smd 0.254 x 0.254: A1 -4,4; A2 -3.2,4; A3 -2.4,4; A4 -1.6,4; A5 -0.8,4; A6 0,4; A7 0.8,4; A8 1.6,4; A9 2.4,4; A10 3.2,4; A11 4,4; B1 -4,3.2; B2 -3.2,3.2; B3 -2.4,3.2; B4 -1.6,3.2; B5 -0.8,3.2; B6 0,3.2; B7 0.8,3.2; B8 1.6,3.2; B9 2.4,3.2; B10 3.2,3.2; B11 4,3.2; C1 -4,2.4; C2 -3.2,2.4; C3 -2.4,2.4; C4 -1.6,2.4; C5 -0.8,2.4; C6 0,2.4; C7 0.8,2.4; C8 1.6,2.4; C9 2.4,2.4; C10 3.2,2.4; C11 4,2.4; D1 -4,1.6; D2 -3.2,1.6; D3 -2.4,1.6; D4 -1.6,1.6; D5 -0.8,1.6; D6 0,1.6; D7 0.8,1.6; D8 1.6,1.6; D9 2.4,1.6; D10 3.2,1.6; D11 4,1.6; E1 -4,0.8; E2 -3.2,0.8; E3 -2.4,0.8; E4 -1.6,0.8; E5 -0.8,0.8; E6 0,0.8; E7 0.8,0.8; E8 1.6,0.8; E9 2.4,0.8; E10 3.2,0.8; E11 4,0.8; F1 -4,0; F2 -3.2,0; F3 -2.4,0; F4 -1.6,0; F5 -0.8,0; F6 0,0; F7 0.8,0; F8 1.6,0; F9 2.4,0; F10 3.2,0; F11 4,0; G1 -4,-0.8; G2 -3.2,-0.8; G3 -2.4,-0.8; G4 -1.6,-0.8; G5 -0.8,-0.8; G6 0,-0.8; G7 0.8,-0.8; G8 1.6,-0.8; G9 2.4,-0.8; G10 3.2,-0.8; G11 4,-0.8; H1 -4,-1.6; H2 -3.2,-1.6; H3 -2.4,-1.6; H4 -1.6,-1.6; H5 -0.8,-1.6; H6 0,-1.6; H7 0.8,-1.6; H8 1.6,-1.6; H9 2.4,-1.6; H10 3.2,-1.6; H11 4,-1.6; J1 -4,-2.4; J2 -3.2,-2.4; J3 -2.4,-2.4; J4 -1.6,-2.4; J5 -0.8,-2.4; J6 0,-2.4; J7 0.8,-2.4; J8 1.6,-2.4; J9 2.4,-2.4; J10 3.2,-2.4; J11 4,-2.4; K1 -4,-3.2; K2 -3.2,-3.2; K3 -2.4,-3.2; K4 -1.6,-3.2; K5 -0.8,-3.2; K6 0,-3.2; K7 0.8,-3.2; K8 1.6,-3.2; K9 2.4,-3.2; K10 3.2,-3.2; K11 4,-3.2; L1 -4,-4; L2 -3.2,-4; L3 -2.4,-4; L4 -1.6,-4; L5 -0.8,-4; L6 0,-4; L7 0.8,-4; L8 1.6,-4; L9 2.4,-4; L10 3.2,-4; L11 4,-4
SJ_2 = smd 1.168 x 1.6: 1 -1.524,0; 2 0,0; 3 1.524,0
2520 = smd 1.2 x 1: 1 -0.95,-0.75; 2 0.95,-0.75; 3 0.95,0.75; 4 -0.95,0.75

### Placement (x,y rotation side)
C1  3.3,27.2 0 top
C2  3.3,26 0 top
C3  19.85,24.3 0 top
C4  7.5,24.1 90 top
C5  16.1,23.8 270 top
C6  17.7,23.8 270 top
C7  23.3,23.4 0 top
C8  23.3,22.5 0 top
C9  11,22.2 180 top
C10  26.5,22.2 0 top
C11  23.3,21.6 0 top
C12  5.5,21.5 0 top
C13  23.3,20.7 0 top
C14  11,20.6 180 top
C15  3.3,19.7 0 top
C16  13.7,19.4 180 top
C17  22.5,18.6 0 top
C18  3.3,18.5 0 top
C19  11,18 180 top
C20  26.5,17.8 180 top
C21  21.3,17.7 0 top
C22  21.3,16.8 0 top
C23  7.5,16.6 90 top
C24  21.3,15.9 0 top
C25  12.5,14.6 270 top
C26  13.4,14.6 270 top
C27  14.9,14.6 270 top
C28  15.8,14.6 270 top
C29  25.1,14.5 90 top
C30  5.5,14 0 top
C31  18.4,13.8 270 top
C32  19.3,13.8 270 top
C33  17.4,13.6 270 top
C34  20.7,13.3 180 top
C35  3.4,12.2 0 top
C36  3.4,11 0 top
C37  7.6,8.4 90 top
C38  5.5,6.5 0 top
C39  15.4,1.3 180 top
C40  20.5,10.55 0 bottom
C41  13.5,10.55 180 bottom
C42  20.5,11.45 0 bottom
C43  13.5,11.45 180 bottom
D1  15,9 90 top
D2  19.1,9 90 top
D3  24,11.1 90 bottom
J1  17,30 180 top
J2  17,4 0 bottom
JTAG  32.5,17 270 top
L1  5.7,23.7 90 top
L2  14.2,16.5 270 top
L3  15.1,16.5 270 top
L4  19.8,16.4 270 top
L5  5.7,16.2 90 top
L6  20.7,14.3 180 top
L7  5.7,8.7 90 top
LED1  26.5,2.5 0 bottom
LED2  24.5,2.5 0 bottom
LED3  7,2.5 0 bottom
R1  11,24.3 0 top
R2  11,23.2 0 top
R3  2.7,22.8 180 top
R4  2.7,21.5 180 top
R5  13.8,21 0 top
R6  16,19.4 0 top
R7  11,19 0 top
R8  11,17 0 top
R9  2.7,15.3 180 top
R10  27.65,14.5 270 top
R11  28.9,14.5 270 top
R12  2.7,14 180 top
R13  2.8,7.7 180 top
R14  2.8,6.5 180 top
R15  18.5,1.3 180 top
R16  15,0.8 0 bottom
R17  26.5,5 90 bottom
R18  24.5,5 90 bottom
R19  7,5 90 bottom
R20  28.5,7.5 90 bottom
R21  19,7.7 180 bottom
R22  13,13.5 180 bottom
R23  28,26.5 0 bottom
T1  31.5,7.5 180 bottom
T2  6.5,18.5 270 bottom
T3  31.5,26.5 180 bottom
U1  3,24.5 180 top
U2  3,17 180 top
U3  3.1,9.5 180 top
U4  27,9 0 top
U5  8.5,3.5 0 top
U6  17,13 270 bottom
U7  16.9,20.6 180 bottom
VIO  9,12.2 270 top
X1  26.5,20 90 top

### Tracks (layer width: path | path; a pad name or v marks a point on that pad's centre or on a via)
+1V2  (via drill 0.3)
  Top 0.3: C11.1 22.55,21.6 22.05,21.1 20.4,21.1 19.7,20.4 v19.7,20.2
  Top 0.4: L4.1 v19.8,17.7 C21.1 | v14.1,17.8 14.1,17.15 L2.1 | C13.1 22.65,20.6 v21.4,20.6 | v12.5,22.2 C9.1 | C7.1 21.75,23.4 21.35,23 v21.3,23 | C5.1 v16.1,25 | C6.1 v17.7,25
  Top 0.5: L2.1 L3.1
  Top 0.6: R4.1 C12.1 4.65,22.45 4.9,22.7 L1.1
  Bottom 0.15: U7.B10 v19.8,17.7 | U7.E9 v19.7,20.2 | U7.F11 v21.4,20.6 | U7.J11 v21.3,23 | U7.H1 v12.5,22.2 | U7.L7 v17.7,25 | U7.L5 v16.1,25 | U7.C3 v14.1,17.8
  other vias: 7.3,22.9 7.8,22.9 7.3,22.4 7.8,22.4
  pour Top (no thermals): 4.4,23.1 6.6,23.1 7.3,23.8 8,23.8 8,22.3 4.4,22.3
  pour Route3: 6.9,22.9 8.6,24.6 15.5,24.6 16.1,25.2 16.7,24.6 17.1,24.6 17.7,25.2 18.3,24.6 20.4,24.6 21.5,23.5 21.5,19.1 19.4,17 19,17.4 18,17.4 17.6,17 12,17 7.7,21.3 7.7,22 7.5,22.2 7,22.2 6.9,22.3
+1V8  (via drill 0.3)
  Top 0.2: R11.1 30.6,15 30.9,15.3 30.9,22.6 31.3,23 JTAG.1
  Top 0.4: C17.1 v21.3,18.6 | 25.15,13.9 v25.8,13.9 | R10.1 v27,15 | R7.1 9.8,19 9.6,18.8 v9.6,18.1
  Top 0.5: R10.1 R11.1 | U4.8 C29.1 25.15,13.9 | L6.1 C34.1 v21.9,13.3
  Top 0.6: R12.1 C30.1 4.9,14.25 4.9,15.2 L5.1 | VIO.1 9,15.25 8.2,16.05 C23.1
  Bottom 0.15: U7.C11 v21.3,18.6
  other vias: 7.3,14.9 7.3,15.4 7.8,15.4 7.8,14.9
  pour Top (no thermals): 4.6,15.6 6.5,15.6 7.2,16.3 7.9,16.3 7.9,14.8 4.6,14.8
  pour Route14: 25.5,13.1 8.7,13.1 7.7,14.1 7.7,14.5 7.5,14.7 7.1,14.7 6.9,14.9 6.9,15.9 9.4,18.4 9.9,18.4 12.5,15.8 18.3,15.8 21.3,18.8 23.2,18.8 23.3,18.7 23.3,18.4 23.5,18.2 24.2,18.2 27.3,15.1 27.3,14.9 26.7,14.3 26.2,14.3 26,14.1 26,13.6
+3V3  (via drill 0.3)
  Top 0.4: v17.4,14.7 C33.1
  Top 0.6: R14.1 C38.1 4.65,7.45 4.9,7.7 L7.1 5.85,7.85 C37.1 8.85,7.85 9,8 v9,9.3 v9,9.8 VIO.3
  Route3 0.5: v9,9.3 v9,9.8 9,13 10.1,14.1 17.1,14.1 17.4,14.4 v17.4,14.7
  Bottom 0.15: U6.3 17.2,14.5 v17.4,14.7
+5V  (via drill 0.3)
  Top 0.3: U2.3 U2.4 1,17.5 | U3.3 U3.4 1,10 | U1.3 U1.4 1,25 | 9,27 9.5,27 J1.66 J1.65 | 9,27 J1.68 J1.67 | 9,27 8.5,27 | 8.5,27 J1.70 J1.69 | 8.5,27 8.1,27 8,27.1
  Top 0.6: 1,26 C2.1 2.75,26.3 C1.1 | 1,18.4 1.1,18.5 C18.1 2.75,18.8 C15.1 | 1,11 C36.1 2.66,11.11 2.85,11.3 C35.1
  Top 0.8: U5.5 7.41,4.8 4.71,4.8 4.11,5.4 1.3,5.4 1,5.7 1,10 1,11 1,17.5 1,18.4 v1,20.5 1,25 1,26 1,28 1.4,28.4 4.7,28.4 6,27.1 8,27.1
  Route14 0.15: v20.5,19.4 20.1,19.4 19.7,19 19.7,18.6 19.1,18 17.2,18 17,18.2 11.4,18.2 9.1,20.5 v1,20.5
  Bottom 0.15: U7.E11 v20.5,19.4
AVDD  (via drill 0.3)
  Top 0.4: v18.1,16.2 18.45,15.85 L4.2
  Top 0.5: C22.1 C24.1 20.7,15.85 L4.2
  Bottom 0.15: U7.A7 v18.1,16.2
BUTTON  (via drill 0.3)
  Route2 0.15: v17.3,21.7 17.6,21.4 21.1,21.4 23.7,24 26.6,24 v29.1,26.5
  Bottom 0.152: U7.H6 17.3,21.8 v17.3,21.7
  Bottom 0.4: R23.1 v29.1,26.5 T3.P$2
CC1
  Bottom 0.3: J2.A5 16.25,0.95 16.1,0.8 R16.1
CC2
  Bottom 0.3: J2.B5 17.75,7.55 17.9,7.7 R21.1
CVDDQ  (via drill 0.3)
  Top 0.4: C31.1 18.4,14.7 17.3,15.8 v17.3,17
  Top 0.5: C31.1 C32.1 20.1,14.35 L6.2
  Bottom 0.15: U7.B6 v17.3,17
FPGA_CTL0  (via drill 0.3)
  Top 0.2: J1.30 v18.5,26.6
  Bottom 0.15: U7.K8 18.9,24.2 18.9,25.8 18.5,26.2 v18.5,26.6
FPGA_CTL1  (via drill 0.3)
  Top 0.2: J1.23 v20,31.4
  Bottom 0.15: U7.K7 18.1,24.2 18.1,26.1 18,26.2 18,29.4 v20,31.4
FPGA_CTL2  (via drill 0.3)
  Top 0.2: J1.34 v17.5,26.3
  Bottom 0.15: U7.J7 17.3,23.4 17.3,26.1 v17.5,26.3
FPGA_CTL3  (via drill 0.3)
  Top 0.2: J1.36 v17,26.6
  Route14 0.15: v18.1,22.6 17.3,23.4 17.3,25.9 17,26.2 v17,26.6
  Bottom 0.15: U7.H7 v18.1,22.6
FPGA_CTL4  (via drill 0.3)
  Route14 0.15: v17.3,21 17.7,20.6 18.5,20.6 19.3,19.8 29.3,19.8 30.2,18.9 30.2,8.9 26.5,5.2 v26.5,1
  Bottom 0.15: U7.G7 v17.3,21
  Bottom 0.4: LED1.A v26.5,1
FPGA_CTL5  (via drill 0.3)
  Route2 0.15: v7,1 6,2 6,13 5.6,13.4 5.6,22.6 8,25 11,25 12,24 16.3,24 16.5,23.8 v16.5,21.8
  Bottom 0.15: U7.G6 v16.5,21.8
  Bottom 0.4: LED3.A v7,1
FPGA_D0  (via drill 0.3)
  Top 0.2: J1.4 v25,26.2
  Bottom 0.15: U7.F10 20.5,20.2 21.6,20.2 25.5,24.1 25.5,27.8 25.4,27.9 25.1,27.9 25,27.8 v25,26.2
FPGA_D1  (via drill 0.3)
  Top 0.2: J1.6 v24.5,26.6
  Bottom 0.15: U7.F9 19.7,21 21.9,21 24.3,23.4 24.3,26.1 24,26.4 24,27.8 24.1,27.9 24.4,27.9 24.5,27.8 v24.5,26.6
FPGA_D2  (via drill 0.3)
  Top 0.2: J1.18 v21.5,26.6
  Route14 0.15: v18.1,21 18.5,21.4 20.1,21.4 20.9,22.2 20.9,24.8 21.45,25.35 21.45,25.95 22,26.5 22,28.5 21.9,28.6 21.6,28.6 21.5,28.5 v21.5,26.6
  Bottom 0.15: U7.F7 v18.1,21
FPGA_D3  (via drill 0.3)
  Top 0.2: J1.12 v23,26.6
  Bottom 0.15: U7.G10 20.5,21.8 21.5,21.8 23.8,24.1 23.8,25.7 23.7,25.8 23.5,25.8 23.4,25.7 23.4,24.4 23.3,24.3 23.1,24.3 23,24.4 v23,26.6
FPGA_D4  (via drill 0.3)
  Top 0.2: J1.9 v23.5,31.7
  Route14 0.15: v19.7,21.8 20.5,22.6 20.5,25 21,25.5 21,28.5 23.5,31 v23.5,31.7
  Bottom 0.15: U7.G9 v19.7,21.8
FPGA_D5  (via drill 0.3)
  Top 0.2: J1.10 v23.5,26.3
  Route14 0.15: v18.9,21 21.8,21 22.7,21.9 22.7,23.9 22.8,24 23,24 23.1,23.9 23.1,22.5 23.2,22.4 23.4,22.4 23.5,22.5 v23.5,26.3
  Bottom 0.15: U7.F8 v18.9,21
FPGA_D6  (via drill 0.3)
  Top 0.2: J1.5 v24.5,31.4
  Bottom 0.15: U7.H10 20.5,22.6 21.5,22.6 22.6,23.7 22.6,29.5 v24.5,31.4
FPGA_D7  (via drill 0.3)
  Top 0.2: J1.22 v20.5,25.9
  Route14 0.15: v19.7,22.6 20.1,23 20.1,26.07 20.38,26.34 20.38,28.7 20.48,28.8 20.6,28.8 20.7,28.7 20.7,26.1 v20.5,25.9
  Bottom 0.15: U7.H9 v19.7,22.6
FPGA_D8  (via drill 0.3)
  Top 0.2: J1.16 v22,25.9
  Bottom 0.15: U7.J10 20.5,23.4 21.5,23.4 22,23.9 22,25.1 21.5,25.6 21.5,26.07 22,26.57 22,28.1 22.1,28.2 22.2,28.2 22.3,28.1 22.3,26.2 v22,25.9
FPGA_D9  (via drill 0.3)
  Top 0.2: J1.15 v22,31.7
  Route14 0.15: v19.7,23.4 19.7,25.8 19.5,26 19.5,26.6 19.1,27 19.1,28.5 19.2,28.6 19.4,28.6 19.5,28.5 19.5,27.3 19.6,27.2 19.8,27.2 19.9,27.3 19.9,28.9 22,31 v22,31.7
  Bottom 0.15: U7.J9 v19.7,23.4
FPGA_D10  (via drill 0.3)
  Top 0.2: J1.3 v25,31.7
  Route14 0.15: v21.3,23.8 22.1,23.8 22.5,24.2 22.5,28.5 25,31 v25,31.7
  Bottom 0.15: U7.K11 v21.3,23.8
FPGA_D11  (via drill 0.3)
  Top 0.2: J1.24 v20,26.6
  Bottom 0.15: U7.L10 20.1,25.9 | 20.5,29.4 21.13,30.03 21.13,30.17 21.02,30.28 20.88,30.28 20.1,29.5
  Bottom 0.152: 20.1,25.9 20.1,26.1 20.5,26.5 20.5,29.4 | 20.1,29.5 20,29.4 v20,26.6
FPGA_D12  (via drill 0.3)
  Top 0.2: J1.11 v23,31.4
  Bottom 0.15: U7.K10 20.5,24.2 20.5,25 21,25.5 21,26.8 21.6,27.4 21.6,29 21.5,29.1 21.3,29.1 21.2,29 21.2,27.7 21.1,27.6 20.95,27.6 20.85,27.7 20.85,29.25 v23,31.4
FPGA_D13  (via drill 0.3)
  Top 0.2: J1.17 v21.5,31.4
  Bottom 0.15: U7.K9 19.7,24.2 19.7,25.8 19.5,26 19.5,26.9 19.3,27.1 18.8,27.1 18.7,27.2 18.7,29.1 18.8,29.2 19,29.2 19.1,29.1 19.1,27.8 19.2,27.7 19.4,27.7 19.5,27.8 19.5,29.4 v21.5,31.4
FPGA_D14  (via drill 0.3)
  Top 0.2: J1.21 v20.5,31.7
  Route14 0.15: v18.9,23.4 18.4,23.9 18.4,25.8 18,26.2 18,28.5 20.5,31 v20.5,31.7
  Bottom 0.15: U7.J8 v18.9,23.4
FPGA_D15  (via drill 0.3)
  Top 0.2: J1.28 v19,26.3
  Route14 0.15: v19,26.3 19,25.9 18.9,25.8 18.9,24.2 19.3,23.8 19.3,22.4 19.1,22.2 17.9,22.2 17.3,22.8 17.3,23 17.2,23.1 17,23.1 16.9,23 16.9,22.7 17.8,21.8 v18.9,21.8
  Bottom 0.15: U7.G8 v18.9,21.8
FPGA_D16  (via drill 0.3)
  Top 0.2: J1.35 v17,31.4
  Bottom 0.15: U7.K2 14.1,24.2 14.1,25.3 15,26.2 15,26.6 14.4,27.2 14.4,28.5 14.5,28.6 14.6,28.6 14.7,28.5 14.7,27.6 14.8,27.5 14.9,27.5 15,27.6 15,29.4 v17,31.4
FPGA_D17  (via drill 0.3)
  Top 0.2: J1.40 v16,26.6
  Bottom 0.15: U7.J4 15.7,23.4 15.7,25.6 16.03,25.93 16.03,26.07 15.4,26.7 15.4,29.3 16.5,30.4 16.6,30.4 16.73,30.27 16.73,30.13 16,29.4 v16,26.6
FPGA_D18  (via drill 0.3)
  Top 0.2: J1.54 v12.5,26.6
  Bottom 0.15: U7.K1 12.4,24.3 12.4,25.9 13,26.5 13,29.4 13.6,30 13.6,30.1 13.47,30.23 13.33,30.23 12.5,29.4 v12.5,26.6
FPGA_D19  (via drill 0.3)
  Top 0.2: J1.41 v15.5,31.4
  Bottom 0.15: U7.J2 13.3,23.4 13.3,25.3 13.5,25.5 13.5,27 14,27.5 14,28.7 13.9,28.8 13.8,28.8 13.7,28.7 13.7,27.8 13.6,27.7 13.5,27.7 13.4,27.8 13.4,29.3 v15.5,31.4
FPGA_D20  (via drill 0.3)
  Top 0.2: J1.48 v14,26.6
  Route14 0.15: v14.9,22.6 U7.J3 14.5,23.8 14.1,24.2 14.1,25.86 13.5,26.46 13.5,27.9 14.33,28.73 14.47,28.73 14.58,28.62 14.58,28.48 14,27.9 v14,26.6
  Bottom 0.15: U7.J3 v14.9,22.6
FPGA_D21  (via drill 0.3)
  Top 0.2: J1.47 v14,31.4
  Bottom 0.15: U7.J1 12,23.9 12,28.6 11.9,28.7 11.8,28.7 11.7,28.6 11.7,27.6 11.6,27.5 11.5,27.5 11.4,27.6 11.4,28.8 v14,31.4
FPGA_D22  (via drill 0.3)
  Top 0.2: J1.45 v14.5,31.7
  Route14 0.15: v13.3,22.6 11.9,24 11.9,26 12.1,26.2 12.1,28.6 14.5,31 v14.5,31.7
  Bottom 0.15: U7.H2 v13.3,22.6
FPGA_D23  (via drill 0.3)
  Top 0.2: J1.39 v16,31.7
  Route14 0.15: v14.1,22.6 14.1,23.4 13.3,24.2 13.3,25.3 13.5,25.5 13.5,26 13.1,26.4 13.1,28.1 16,31 v16,31.7
  Bottom 0.15: U7.H3 v14.1,22.6
FPGA_D24  (via drill 0.3)
  Top 0.2: J1.33 v17.5,31.7
  Route14 0.15: v15.7,21 15.7,23.9 14.9,24.7 14.9,28.4 17.5,31 v17.5,31.7
  Bottom 0.15: U7.F4 v15.7,21
FPGA_D25  (via drill 0.3)
  Top 0.2: J1.58 v11.5,26.6
  Route14 0.15: v13.3,21.8 11.8,21.8 11.3,22.3 11.3,23.3 11.4,23.4 11.6,23.4 11.7,23.3 11.7,22.4 11.8,22.3 12,22.3 12.1,22.4 12.1,23.4 11.5,24 v11.5,26.6
  Bottom 0.15: U7.G2 v13.3,21.8
FPGA_D26  (via drill 0.3)
  Top 0.2: J1.52 v13,25.9
  Route14 0.15: v14.1,21.8 14.3,21.6 14.3,21.1 14.2,21 13.3,21 13.2,21.1 13.2,21.3 13.32,21.42 13.6,21.42 13.7,21.52 13.7,23.44 13.57,23.57 13.27,23.57 13.07,23.37 12.93,23.37 12.82,23.48 12.82,23.62 13.08,23.88 13.08,24.02 12.87,24.23 12.73,24.23 12.55,24.05 12.41,24.05 12.25,24.2 12.25,24.65 12.4,24.8 12.4,25.8 12.5,25.9 v13,25.9
  Bottom 0.15: U7.G3 v14.1,21.8
FPGA_D27  (via drill 0.3)
  Top 0.2: J1.51 v13,31.7
  Route14 0.15: v14.9,20.2 U7.F3 13.2,20.6 12.8,21 12.1,21 11,22.1 11,29 13,31 v13,31.7
  Bottom 0.15: U7.F3 v14.9,20.2
FPGA_D28  (via drill 0.3)
  Top 0.2: J1.53 v12.5,31.4
  Bottom 0.15: v12.5,31.4 11,29.9 11,21.4 12.6,19.8 U7.E1
FPGA_D29  (via drill 0.3)
  Top 0.2: J1.27 v19,31.7
  Route14 0.15: v16.5,21 16.9,21.4 16.9,22.2 16.5,22.6 16.5,28.5 19,31 v19,31.7
  Bottom 0.15: v16.5,21 U7.F5
FPGA_D30  (via drill 0.3)
  Top 0.2: J1.42 v15.5,26
  Route14 0.15: v16.5,20.2 16.1,20.6 16.1,24.1 15.7,24.5 15.7,25.4 16,25.7 16,26.07 15.62,26.44 15.62,27.8 15.52,27.9 15.35,27.9 15.25,27.8 15.25,26.25 v15.5,26
  Bottom 0.15: U7.E5 v16.5,20.2
FPGA_D31  (via drill 0.3)
  Top 0.2: J1.46 v14.5,26.3
  Route14 0.15: v14.5,26.3 14.5,24.6 15.3,23.8 U7.E4 15.4,19.7 15.7,19.7 15.8,19.6 15.8,18.9 15.9,18.8 16.02,18.8 16.12,18.9 16.12,20.1 16.02,20.2 v15.7,20.2
  Bottom 0.15: U7.E4 v15.7,20.2
FPGA_PCLK  (via drill 0.3)
  Top 0.2: J1.29 v18.5,31.4
  Bottom 0.15: U7.J6 16.5,23.4 16.5,26.9 17.2,27.6 17.2,29 17.1,29.1 16.9,29.1 16.8,29 16.8,27.9 16.7,27.8 16.5,27.8 16.4,27.9 16.4,29.3 v18.5,31.4
FX3_RXN
  Bottom 0.15: U6.1 16.4,14 15.8,14 15.7,14.1 15.7,16.9 15.6,17 14.9,17 U7.A3
FX3_RXP
  Bottom 0.15: U6.16 15.55,13.6 15.4,13.75 15.4,14.91 15.31,15 14.9,15 14.8,15.1 14.8,15.2 14.9,15.3 15.3,15.3 15.42,15.42 15.42,16.48 U7.A4
FX3_TX_N
  Bottom 0.15: U6.5 18.45,13.6 18.5,13.65 18.5,15.3 18.2,15.6 16.9,15.6 16.65,15.85 16.65,16.35 U7.A6
FX3_TX_P
  Bottom 0.15: U6.4 17.6,14 18.2,14 18.2,15.2 18.1,15.3 16.8,15.3 16.35,15.75 16.35,16.35 U7.A5
GND  (via drill 0.3)
  Top 0.2: J1.49 v13.5,31.5 | J1.13 v22.5,31.5 | J1.19 v21,31.5 | J1.25 v19.5,31.5 | J1.31 v18,31.5 | J1.37 v16.5,31.5 | J1.43 v15,31.5 | J1.7 v24,31.5 | J1.1 v25.5,31.5 | J1.2 v25.5,28.3 | J1.8 v24,28.3
  Top 0.4: D2.3 D2.8 v19.1,10.3 | D1.3 D1.8 v15,10.3
  Bottom 0.15: U7.E2 v13.3,20.2 | U7.D8 v18.1,19.4 | U7.G1 v12.5,21.4 | U7.L11 v21.3,24.6 | U7.K4 15,23.5 v14.9,23.5 14.8,23.5 U7.K3 | U7.L1 v12.9,25 | U7.A1 v12.6,16.3 | U7.A8 v18.1,17 U7.B7 | U6.2 16.8,14.5 v16.6,14.7 | U7.B4 v14.9,17.8 | U7.B2 v13.3,17.8 | U7.E6 v17.3,19.4 | U7.L2 v13.7,25 | U7.B9 v18.9,17 U7.B8 | D3.8 D3.3 | U7.L6 v16.9,25 | v15.3,25.5 14.7,25.5 14.5,25.3 U7.L3 | U7.G11 21.7,21.4 v21.9,21.6
  other vias: 7.3,13.7 7.3,14.3 7.5,17.8 5.1,18.5 3.9,15.3 5.3,11 7.6,9.6 7.3,6.8 7.3,6.2 4,7.7 5.1,26 7.5,25.3 7.3,21.8 7.3,21.2 14.25,4.5 14.25,3.45 19.75,4.5 19.75,3.45 5.1,26.8 4.8,19.7 4.9,12.2 3.9,22.8 9.9,22.2 9.9,20.6 27.3,30.8 28.2,29.2 6.7,29.2 5.8,30.8 27.7,22.2 23.7,18.6 24.5,20.7 24.5,21.6 24.5,22.5 25.1,15.7 26.4,13.9 27.6,4.4 28.9,4.4 24.5,6.1 25.7,6.1 17,0.4 8.5,3.2 9.5,3.2 9.9,17 18.9,22.6
  pour Route2: 0,0 34,0 34,34 0,34
  pour Top (rank 2): 0,0 34,0 34,34 0,34
  pour Bottom: 0,0 34,0 34,34 0,34
  cutout Bottom: 12,15.7 12,25.5 21.8,25.5 21.8,15.7
  cutout Top: 19.6,3 14.4,3 14,3.4 14,6.4 13.4,7 13.4,9.2 13.1,9.5 12.1,9.5 11.3,10.3 11.3,11.7 11.6,12 12.9,12 14.2,13.3 15,13.3 16.4,11.9 22.5,11.9 22.7,11.7 22.7,10.2 22.5,10 21.3,10 20.8,9.5 20.8,7.4 20,6.6 20,3.4
  cutout Bottom: 14.6,6.1 14.6,9 14.1,9.5 12,9.5 11.3,10.2 11.3,11.7 12,12.4 13.3,12.4 13.8,12.9 13.8,16.1 21.9,16.1 23.8,14.2 23.8,8.2 23.6,8 19.6,8 19.6,6.1
  pour Route15 (rank 2): 0,0 34,0 34,34 0,34
  pour Route3 (rank 2): 0,0 34,0 34,34 0,34
  pour Route14 (rank 2): 0,0 34,0 34,34 0,34
  cutout Route14: 25.3,32.6 13,32.6 10.6,30.2 10.6,20.4 12.4,18.6 20.6,18.6 26,24 26,31.9
  cutout Bottom: 25.3,32.6 13,32.6 10.6,30.2 10.6,20.4 12.4,18.6 20.6,18.6 26,24 26,31.9
LED  (via drill 0.3)
  Route2 0.15: v21.3,19.2 21.4,19.3 29.5,19.3 30,18.8 30,9 24.5,3.5 v24.5,1
  Bottom 0.15: v21.3,19.2 21.1,19 U7.D11
  Bottom 0.4: v24.5,1 LED2.A
N$00001  (via drill 2.6 pad 4.5)
  other vias: 31.5,31.5
N$00002  (via drill 2.6 pad 4.5)
  other vias: 2.5,31.5
N$00003
  Bottom 0.4: R18.1 LED2.C
N$00005
  Top 0.3: U1.2 5.5,24.5 L1.2
N$00006  (7 unrouted)
  Top 0.6: C39.2 13.67,1.3 13.14,1.83 J2.S_4_H2 | R15.1 20.15,1.3 20.86,2.01 J2.S_3_H1
N$00007  (via drill 2.6 pad 4.5)
  other vias: 2.5,2.5
N$00008  (via drill 2.6 pad 4.5)
  other vias: 31.5,2.5
N$00009  (via drill 0.3)
  Top 0.2: v18.1,18.6 17.7,19 16.9,19 R6.2
  Bottom 0.15: U7.C8 v18.1,18.6
N$00010
  Top 0.3: U3.2 5.5,9.5 L7.2
N$00011  (via drill 0.3)
  Top 0.4: R8.2 v12.2,17
  Bottom 0.15: U7.B3 14.1,17 v12.2,17
N$00012
  Top 0.3: U3.5 2.8,9.5 2.9,9.4 2.9,8.5 2.3,7.9 R13.2
  Top 0.6: R14.2 R13.2
N$00013
  Bottom 0.4: R17.1 LED1.C
N$00014
  Bottom 0.4: LED3.C R19.1
N$00015
  Bottom 0.15: U6.7 18.7,12.8 19.2,12.3 19.2,11.4 19.4,11.2 19.75,11.2 19.95,11.4 C42.2
N$00016
  Bottom 0.15: U6.8 18.7,12.4 18.9,12.2 18.9,11.2 19.3,10.8 19.7,10.8 C40.2
N$00017
  Bottom 0.15: C41.2 14.42,10.85 16.25,10.85 16.8,11.4 U6.11
N$00018
  Bottom 0.15: C43.2 14.42,11.15 16.15,11.15 16.4,11.4 U6.12
N$00019
  Bottom 0.4: T1.P$2 29.8,7.2 29.6,7 R20.1
N$00040
  Top 0.3: U1.5 2.7,24.5 2.8,24.4 2.8,23.6 2.2,23 R3.2
  Top 0.6: R4.2 R3.2
N$00045
  Top 0.3: U2.2 5.5,17 L5.2
N$00049
  Top 0.3: U2.5 2.7,17 2.8,16.9 2.8,16.1 2.2,15.5 R9.2
  Top 0.6: R12.2 R9.2
PMODE0  (via drill 0.3)
  Top 0.4: v14.9,21 R5.2
  Route2 0.152: v14.9,21 15.3,20.6 15.3,16.2 16,15.5 21.6,15.5 v28.5,8.6
  Bottom 0.15: U7.G4 v14.9,21
  Bottom 0.4: R20.2 v28.5,8.6
PMODE1  (via drill 0.3)
  Top 0.15: v14.9,21.8 14.5,22.2 14.5,22.9 14.2,23.2 R2.2
  Bottom 0.15: U7.H4 v14.9,21.8
PMODE2  (via drill 0.3)
  Top 0.15: R1.2 14.6,24.3 v15.3,25
  Bottom 0.15: U7.L4 v15.3,25
RESET  (via drill 0.3)
  Top 0.15: v15.7,17.8 15.3,18.2 11.75,18.2 C19.1 | R7.2 11.5,19.6 11.4,19.7 v8,19.7
  Top 0.4: C19.1 11.5,18.05 R7.2
  Bottom 0.15: U7.C5 v15.7,17.8
  Bottom 0.4: T2.P$2 7.5,20.2 v8,19.7
RXVDDQ  (via drill 0.3)
  Top 0.4: C26.1 13.4,15.9 | 13.4,15.9 v13.4,16.3 | L2.2 13.45,15.95 13.4,15.9
  Top 0.5: C26.1 C25.1
  Bottom 0.15: U7.A2 v13.4,16.3
SCL_1V8  (via drill 0.3)
  Top 0.5: U4.6 27.65,12.17 v27.65,13.5 R10.2
  Route2 0.15: v18.9,18.6 19.9,18.6 21.3,17.2 27.4,17.2 27.65,16.95 v27.65,13.5
  Bottom 0.15: U7.D9 v18.9,18.6
SDA_1V8  (via drill 0.3)
  Top 0.5: U4.5 v28.9,13.5 R11.2
  Route2 0.15: v20.5,18.6 21.5,17.6 28.7,17.6 28.9,17.4 v28.9,13.5
  Bottom 0.15: U7.D10 v20.5,18.6
TCK  (via drill 0.3)
  Route2 0.15: v17.3,20.2 17.7,20.6 20.8,20.6 21.2,20.2 30.6,20.2 31.8,19 JTAG.3
  Bottom 0.15: v17.3,20.2 U7.F6
TDI  (via drill 0.3)
  Route2 0.15: v18.1,20.2 18.9,20.2 19.4,19.7 19.8,19.7 20.3,20.2 20.8,20.2 21.1,19.9 30.49,19.9 31.4,18.99 31.4,15.3 31.7,15 JTAG.5
  Bottom 0.15: U7.E7 v18.1,20.2
TDO
  Bottom 0.2: U7.C10 20.5,17.8 31.7,17.8 JTAG.4
TMS  (via drill 0.3)
  Route2 0.15: v18.9,19.4 19.1,19.2 19.7,19.2 20.4,19.9 20.6,19.9 20.9,19.6 30.4,19.6 31.1,18.9 31.1,13.4 31.5,13 JTAG.6
  Bottom 0.15: U7.E8 v18.9,19.4
TRST
  Bottom 0.2: U7.B11 31,17.4 31.3,17.1 31.3,11.4 31.7,11 JTAG.7
TXVDDQ  (via drill 0.3)
  Top 0.4: 15.1,15.15 C28.1 15.8,15.2 16.5,15.9 v16.5,17
  Top 0.5: C27.1 15.1,15.15 L3.2
  Bottom 0.15: U7.B5 v16.5,17
UART_CTS  (via drill 0.3)
  Top 0.2: v10,31.7 J1.63
  Bottom 0.15: U7.C1 10.6,18.2 8.6,20.2 8.6,26.1 10,27.5 v10,31.7
UART_RTS  (via drill 0.3)
  Top 0.2: J1.61 v10.5,31.4
  Route14 0.15: v14.9,18.6 14.1,19.4 11.8,19.4 9.1,22.1 9.1,26.6 10.1,27.6 10.1,31 v10.5,31.4
  Bottom 0.15: U7.D4 v14.9,18.6
UART_RX  (via drill 0.3)
  Top 0.2: J1.62 v10.5,26.3
  Bottom 0.15: U7.D5 15.7,19.4 10.4,19.4 9.2,20.6 9.2,25 v10.5,26.3
UART_TX  (via drill 0.3)
  Top 0.2: J1.64 v10,26.6
  Bottom 0.15: U7.C2 13.3,18.6 10.7,18.6 8.9,20.4 8.9,25.5 v10,26.6
USB3_MUX_!OE  (via drill 0.3)
  Route2 0.15: v12.5,19 11.5,18 11.5,15.5 R22.2 v14.1,13.5
  Bottom 0.15: U6.15 15.2,13.2 14.9,13.5 v14.1,13.5 R22.2 | U7.D1 v12.5,19
USB3_MUX_SEL  (via drill 0.3)
  Route2 0.15: v14.1,18.6 14.5,18.2 14.5,15.5 17.5,12.5 v19.8,12.5
  Bottom 0.15: U7.D3 v14.1,18.6 | U6.6 19.14,13.2 19.8,12.54 v19.8,12.5
USB_D_N
  Bottom 0.15: J2.A7 17.25,3.75 16.75,4.25 J2.B7 16.85,5.75 16.85,8.35 17.65,9.15 22.7,9.15 23.09,9.54 23.09,10.21 22.98,10.32 D3.5 | U7.A10 20.1,16.4 20.51,15.99 20.9,15.6 20.9,15.5 20.7,15.3 20.7,15.2 21,14.9 21.1,14.9 21.3,15.1 21.41,15.1 21.7,14.81 21.7,14.7 21.5,14.5 21.5,14.4 21.8,14.1 21.9,14.1 22.1,14.3 22.2,14.3 23.1,13.4 23.1,12 22.98,11.88 D3.6
  Bottom 0.2: D3.5 D3.6
USB_D_P  (via drill 0.3)
  Top 0.15: v16.6,3.6 v17.4,4.4
  Bottom 0.15: J2.A6 16.75,3.45 v16.6,3.6 | v17.4,4.4 17.25,4.55 J2.B6 17.15,5.75 17.15,8.25 17.75,8.85 22.8,8.85 23.41,9.46 23.41,10.21 23.49,10.29 D3.4 | U7.A9 19.7,17 20.3,17 20.5,16.8 20.5,16.4 23.4,13.5 23.4,11.97 23.49,11.88 D3.7
  Bottom 0.2: D3.4 D3.7
USB_RX1_N  (via drill 0.3)
  Top 0.15: D1.5 16.02,7.42 v16,7.4 | D1.6 15.9,9.6 15.9,11.1 15,12 v15,12.3
  Top 0.2: D1.5 D1.6
  Bottom 0.15: J2.B10 15.15,5.75 15.15,7.05 15.4,7.3 15.9,7.3 v16,7.4 | U6.13 15.1,12.4 v15,12.3
USB_RX1_P  (via drill 0.3)
  Top 0.15: D1.4 v15.51,7.81 v15.5,7.8 | D1.7 15.6,9.57 15.6,11 14.5,12.1 14.5,12.7 v14.6,12.8
  Top 0.2: D1.4 D1.7
  Bottom 0.15: J2.B11 14.85,5.75 14.85,7.15 v15.5,7.8 | U6.14 v14.6,12.8
USB_RX2_N  (via drill 0.3)
  Top 0.15: v18.7,3.6 18.8,3.7 18.8,5.2 17.68,6.32 17.68,7.22 18.18,7.72 18.18,8.42 D2.1 | D2.10 18.2,9.6 18.2,10.5 18,10.7 v17.7,10.7
  Top 0.2: D2.1 D2.10
  Bottom 0.15: J2.A10 18.75,3.55 v18.7,3.6 | U6.9 17.6,10.8 v17.7,10.7
USB_RX2_P  (via drill 0.3)
  Top 0.15: v19.3,3.8 19.1,4 19.1,5.29 17.96,6.43 17.96,7.06 18.49,7.59 18.49,8.42 D2.2 | D2.9 18.5,9.57 18.5,10.6 17.87,11.23 17.33,11.23 v17.1,11
  Top 0.2: D2.2 D2.9
  Bottom 0.15: J2.A11 19.25,3.75 v19.3,3.8 | U6.10 17.2,11.1 v17.1,11
USB_TX1_N  (via drill 0.3)
  Top 0.15: v15.3,3.6 15.2,3.7 15.2,6.6 14.39,7.41 14.39,8.42 D1.2 | D1.9 14.39,9.58 14.39,10.01 13.9,10.5 12.45,10.5 v12.2,10.75
  Top 0.2: D1.2 D1.9
  Bottom 0.15: J2.A3 15.25,3.55 v15.3,3.6 | C41.1 12.68,10.75 v12.2,10.75
USB_TX1_P  (via drill 0.3)
  Top 0.15: v14.7,3.8 14.9,4 14.9,6.5 14.08,7.32 14.08,8.42 D1.1 | D1.10 14.08,9.58 14.08,9.92 13.8,10.2 12,10.2 11.65,10.55 11.65,10.95 v11.9,11.2
  Top 0.2: D1.1 D1.10
  Bottom 0.15: J2.A2 14.75,3.75 v14.7,3.8 | C43.1 12.62,11.2 v11.9,11.2
USB_TX2_N  (via drill 0.3)
  Top 0.15: D2.4 19.61,7.61 18.8,6.8 v18.7,6.8 | D2.7 19.7,9.59 19.7,10.42 20.38,11.1 21.7,11.1 v21.8,11.2
  Top 0.2: D2.4 D2.7
  Bottom 0.15: v18.7,6.8 18.8,6.7 18.8,5.7 J2.B3 | v21.8,11.2 21.35,11.2 21.1,11.45 C42.1
USB_TX2_P  (via drill 0.3)
  Top 0.15: D2.5 20.12,7.72 19.3,6.9 v19.3,6.6 | D2.6 20,9.6 20,10.3 20.5,10.8 21.9,10.8 v22,10.7
  Top 0.2: D2.5 D2.6
  Bottom 0.15: v19.3,6.6 19.2,6.5 19.2,5.7 J2.B2 | v22,10.7 21.9,10.8 21.3,10.8 C40.1
VBUS  (via drill 0.3)
  Top 0.6: v8,1 v8,1.01
  Top 0.8: v9,1 v8.5,1 v8,1 | v8,1.01 7.51,1.5 U5.1
  Route15 0.5: v15.9,4 15.75,4.15 v15.75,4.6 15.75,5.15 16,5.4 18.1,5.4 18.25,5.25 v18.25,4.6 18.25,4.15 v18.1,4 17.5,3.4 17.5,1.8 16.7,1 v9,1 v8.5,1 v8,1
  Bottom 0.15: J2.B9 v15.75,4.6
  Bottom 0.3: J2.B4 v18.25,4.6 | v18.1,4 18.1,3.3 18.25,3.15 J2.A9 | J2.A4 15.75,3.15 15.9,3.3 v15.9,4
VIO  (via drill 0.3)
  Top 0.4: C8.1 21.6,22.5 v21.3,22.2 | C14.1 v12.5,20.6 12.72,20.82 12.74,20.82 12.92,21 R5.1 | R1.1 v9.9,24.3 | R2.1 v9.9,23.2 | v19.3,25 C3.1 | C16.1 14.1,19.55 v14.1,20.2
  Top 0.5: VIO.2 v10.7,12.2 | VIO.2 9.3,12.5 v10.3,12.5 | VIO.2 9.3,11.9 v10.3,11.9
  Route15 0.2: v21.3,22.2 21.9,22.2 23.7,24 26.6,24 | 26.6,24 27.9,25.3 v33.2,25.3 | v33.35,8.65 33,9 31,9 30.5,9.5 30.5,20.1 26.6,24
  Bottom 0.15: U7.H11 v21.3,22.2 | U7.L9 v19.3,25 | U7.F1 v12.5,20.6 | U7.E3 v14.1,20.2 | U7.B1 12.8,17.4 v12.4,17.8
  Bottom 0.4: T3.P$1 v33.2,25.3 | v33.35,8.65 33.35,7.65 T1.P$1
  pour Route15: 10,11.7 9.7,12 9.7,16.2 10.3,16.8 10.3,17.2 9.7,17.8 9.7,19.8 10.3,20.4 10.3,22.4 9.7,23 9.7,24.4 9.9,24.6 18.3,24.6 18.9,25.2 19.7,25.2 21.5,23.4 21.5,22.2 21.3,22 17.2,22 13.4,18.2 13.1,18.2 12.9,18 12.9,17.7 11.2,16 11.2,12 10.9,11.7
XTAL_IN  (via drill 0.3)
  Top 0.15: v16.5,17.8 16.6,17.7 19,17.7 19.8,18.5 19.8,19.3 20.35,19.85 26.45,19.85 X1.1
  Top 0.5: 27.15,18.95 X1.1
  Top 0.6: C20.1 27.05,18.85 27.15,18.95
  Bottom 0.15: U7.C6 v16.5,17.8
XTAL_OUT  (via drill 0.3)
  Top 0.15: v17.3,18.6 17.9,18 18.9,18 19.5,18.6 19.5,19.4 20.25,20.15 24.95,20.15 X1.3
  Top 0.5: 25.85,21.05 X1.3
  Top 0.6: C10.1 25.95,21.15 25.85,21.05
  Bottom 0.15: U7.C7 v17.3,18.6

### Text on the board
tNames: D1 | D2
bNames: D3 | J2